# EasyEDA Pro project departure_board_display.epro

# Schematic 3_digit_7_segment

## Sheets
1 LEDs: Create Date: 2024-04-22; Page Name: LEDs; Project Name: 3_digit_WS2812B; Schematic Name: 3_digit_7_segment; Update Date: 2024-04-22; Company: Justin&apos;s Engineering Services; Drawed: Justin Forgue; Page Size: A1; Reviewed: EasyEDA Pro; Version: 0
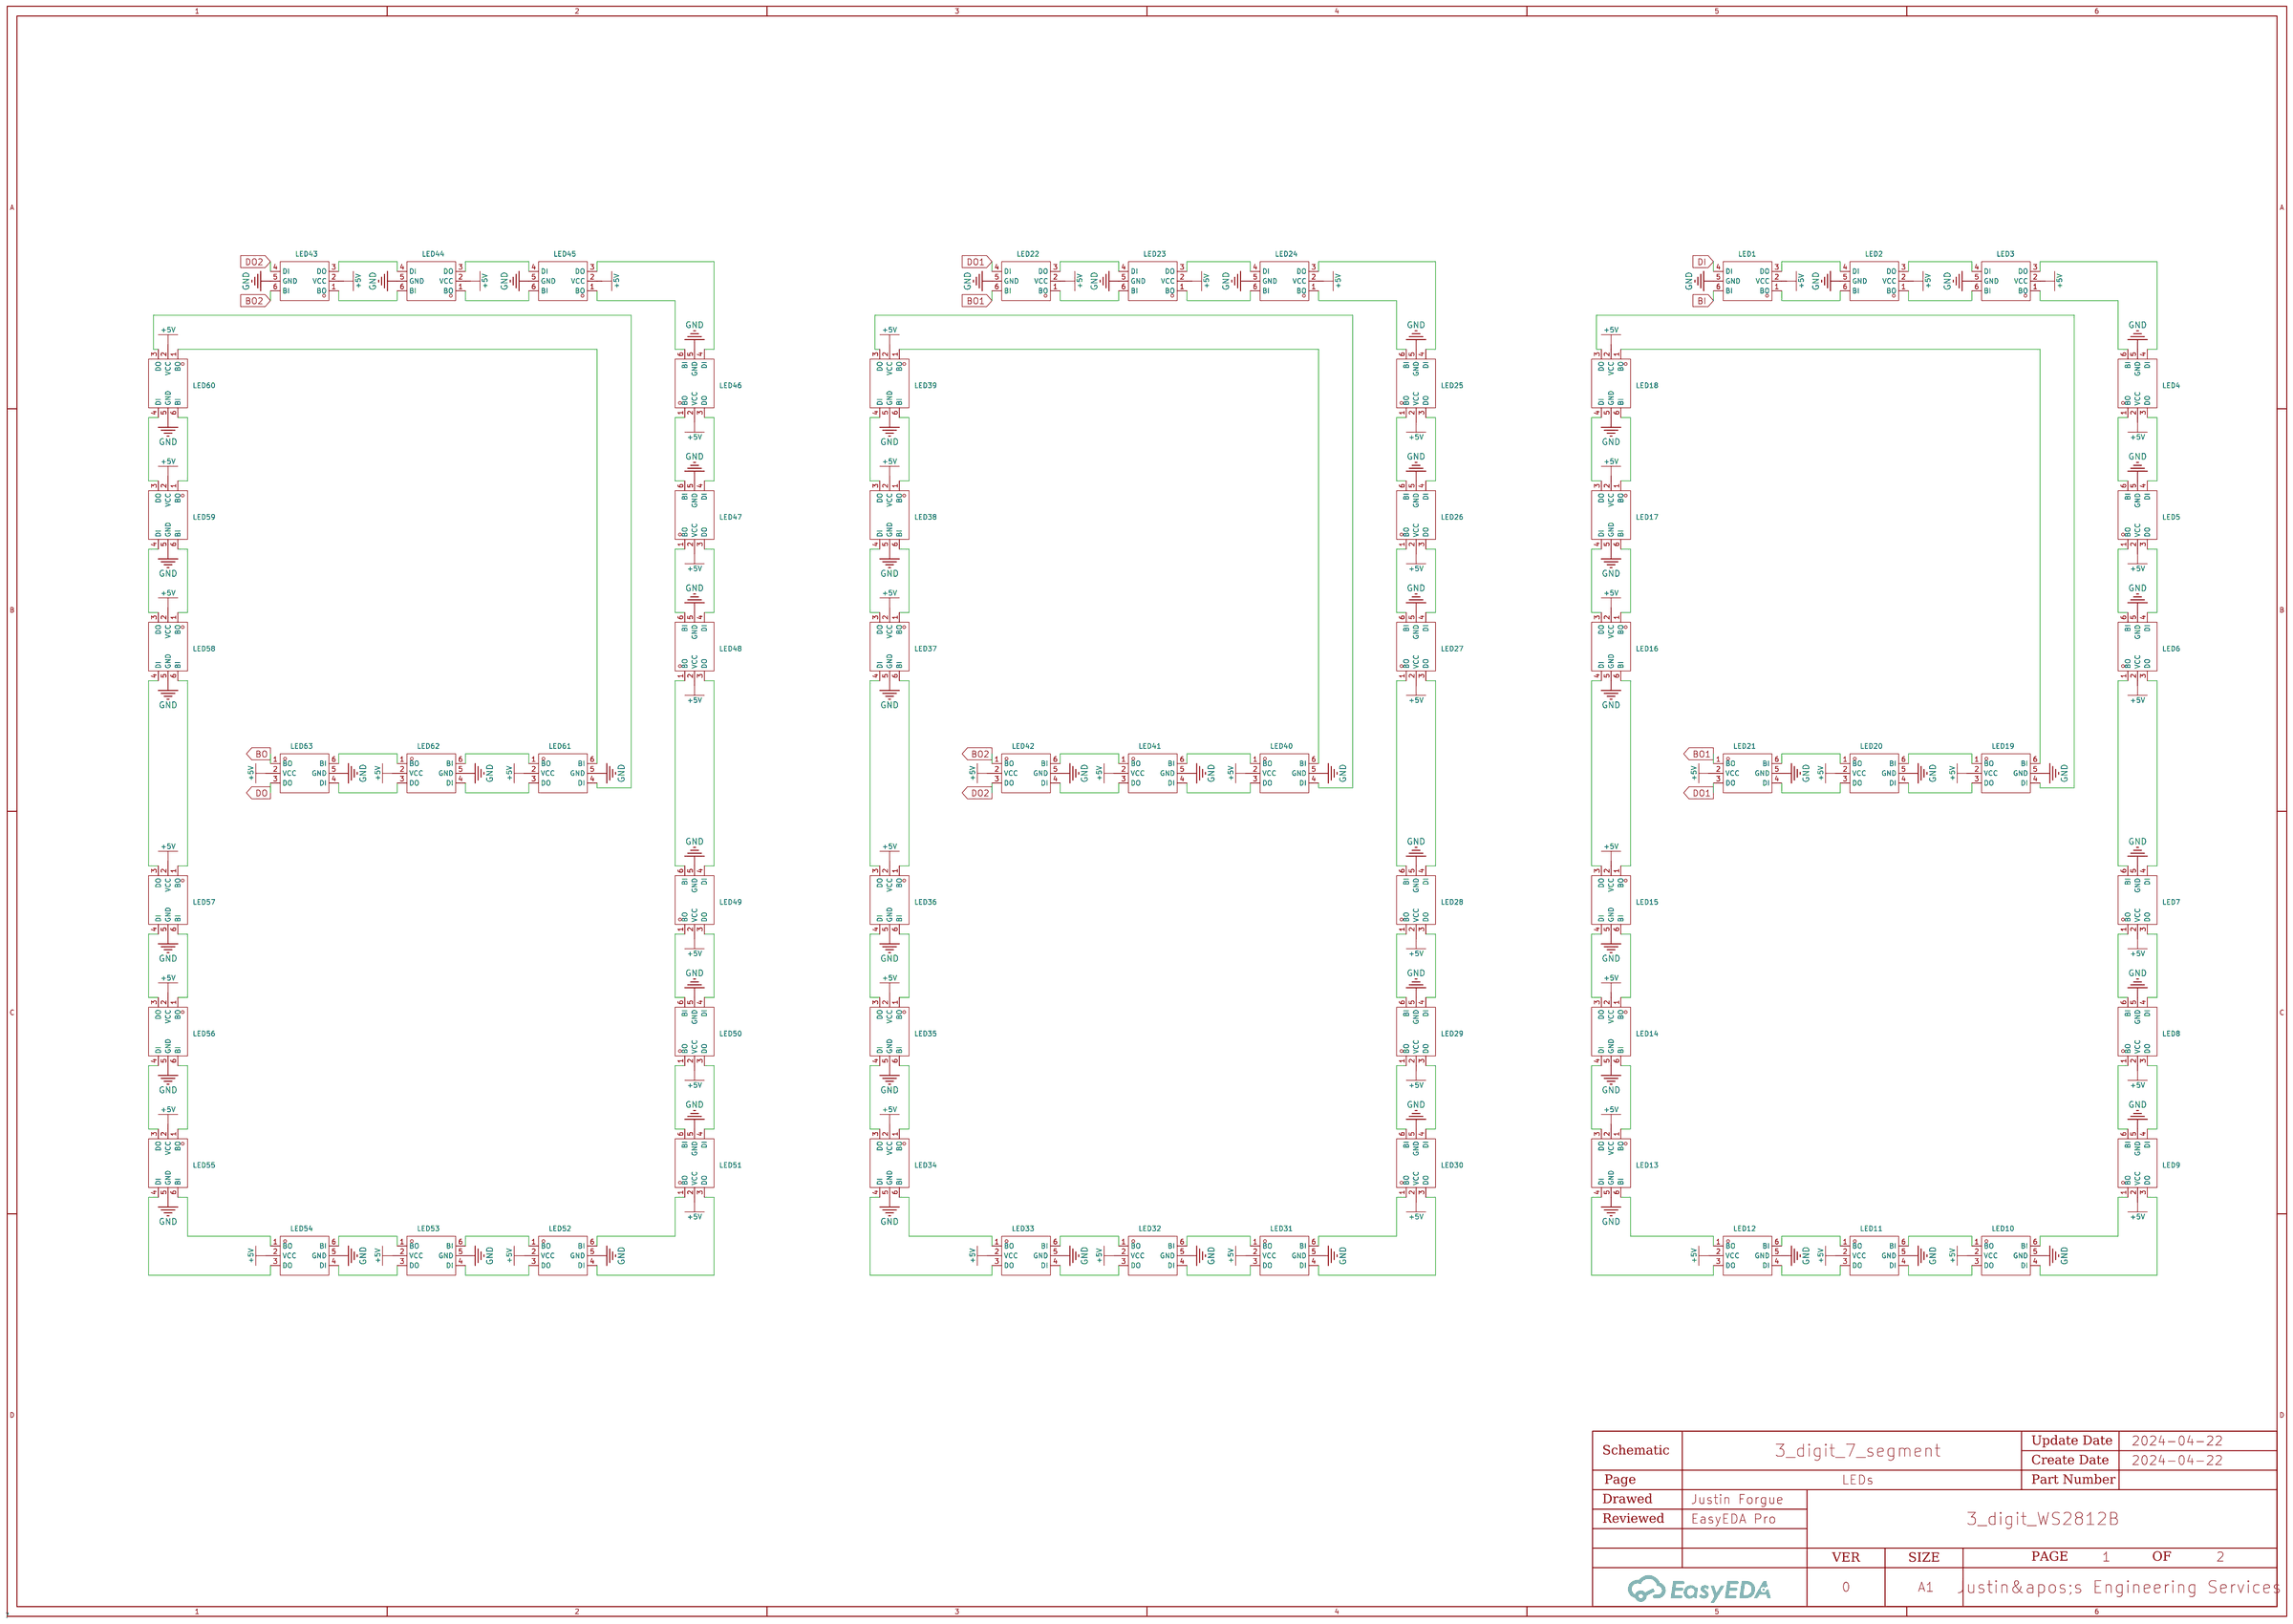
[diagram p0: LEDs]
2 Components: Board Name: Board1; Page Name: Components; Update Date: 2024-08-15; Drawed: EasyEDAPro; Reviewed: EasyEDAPro
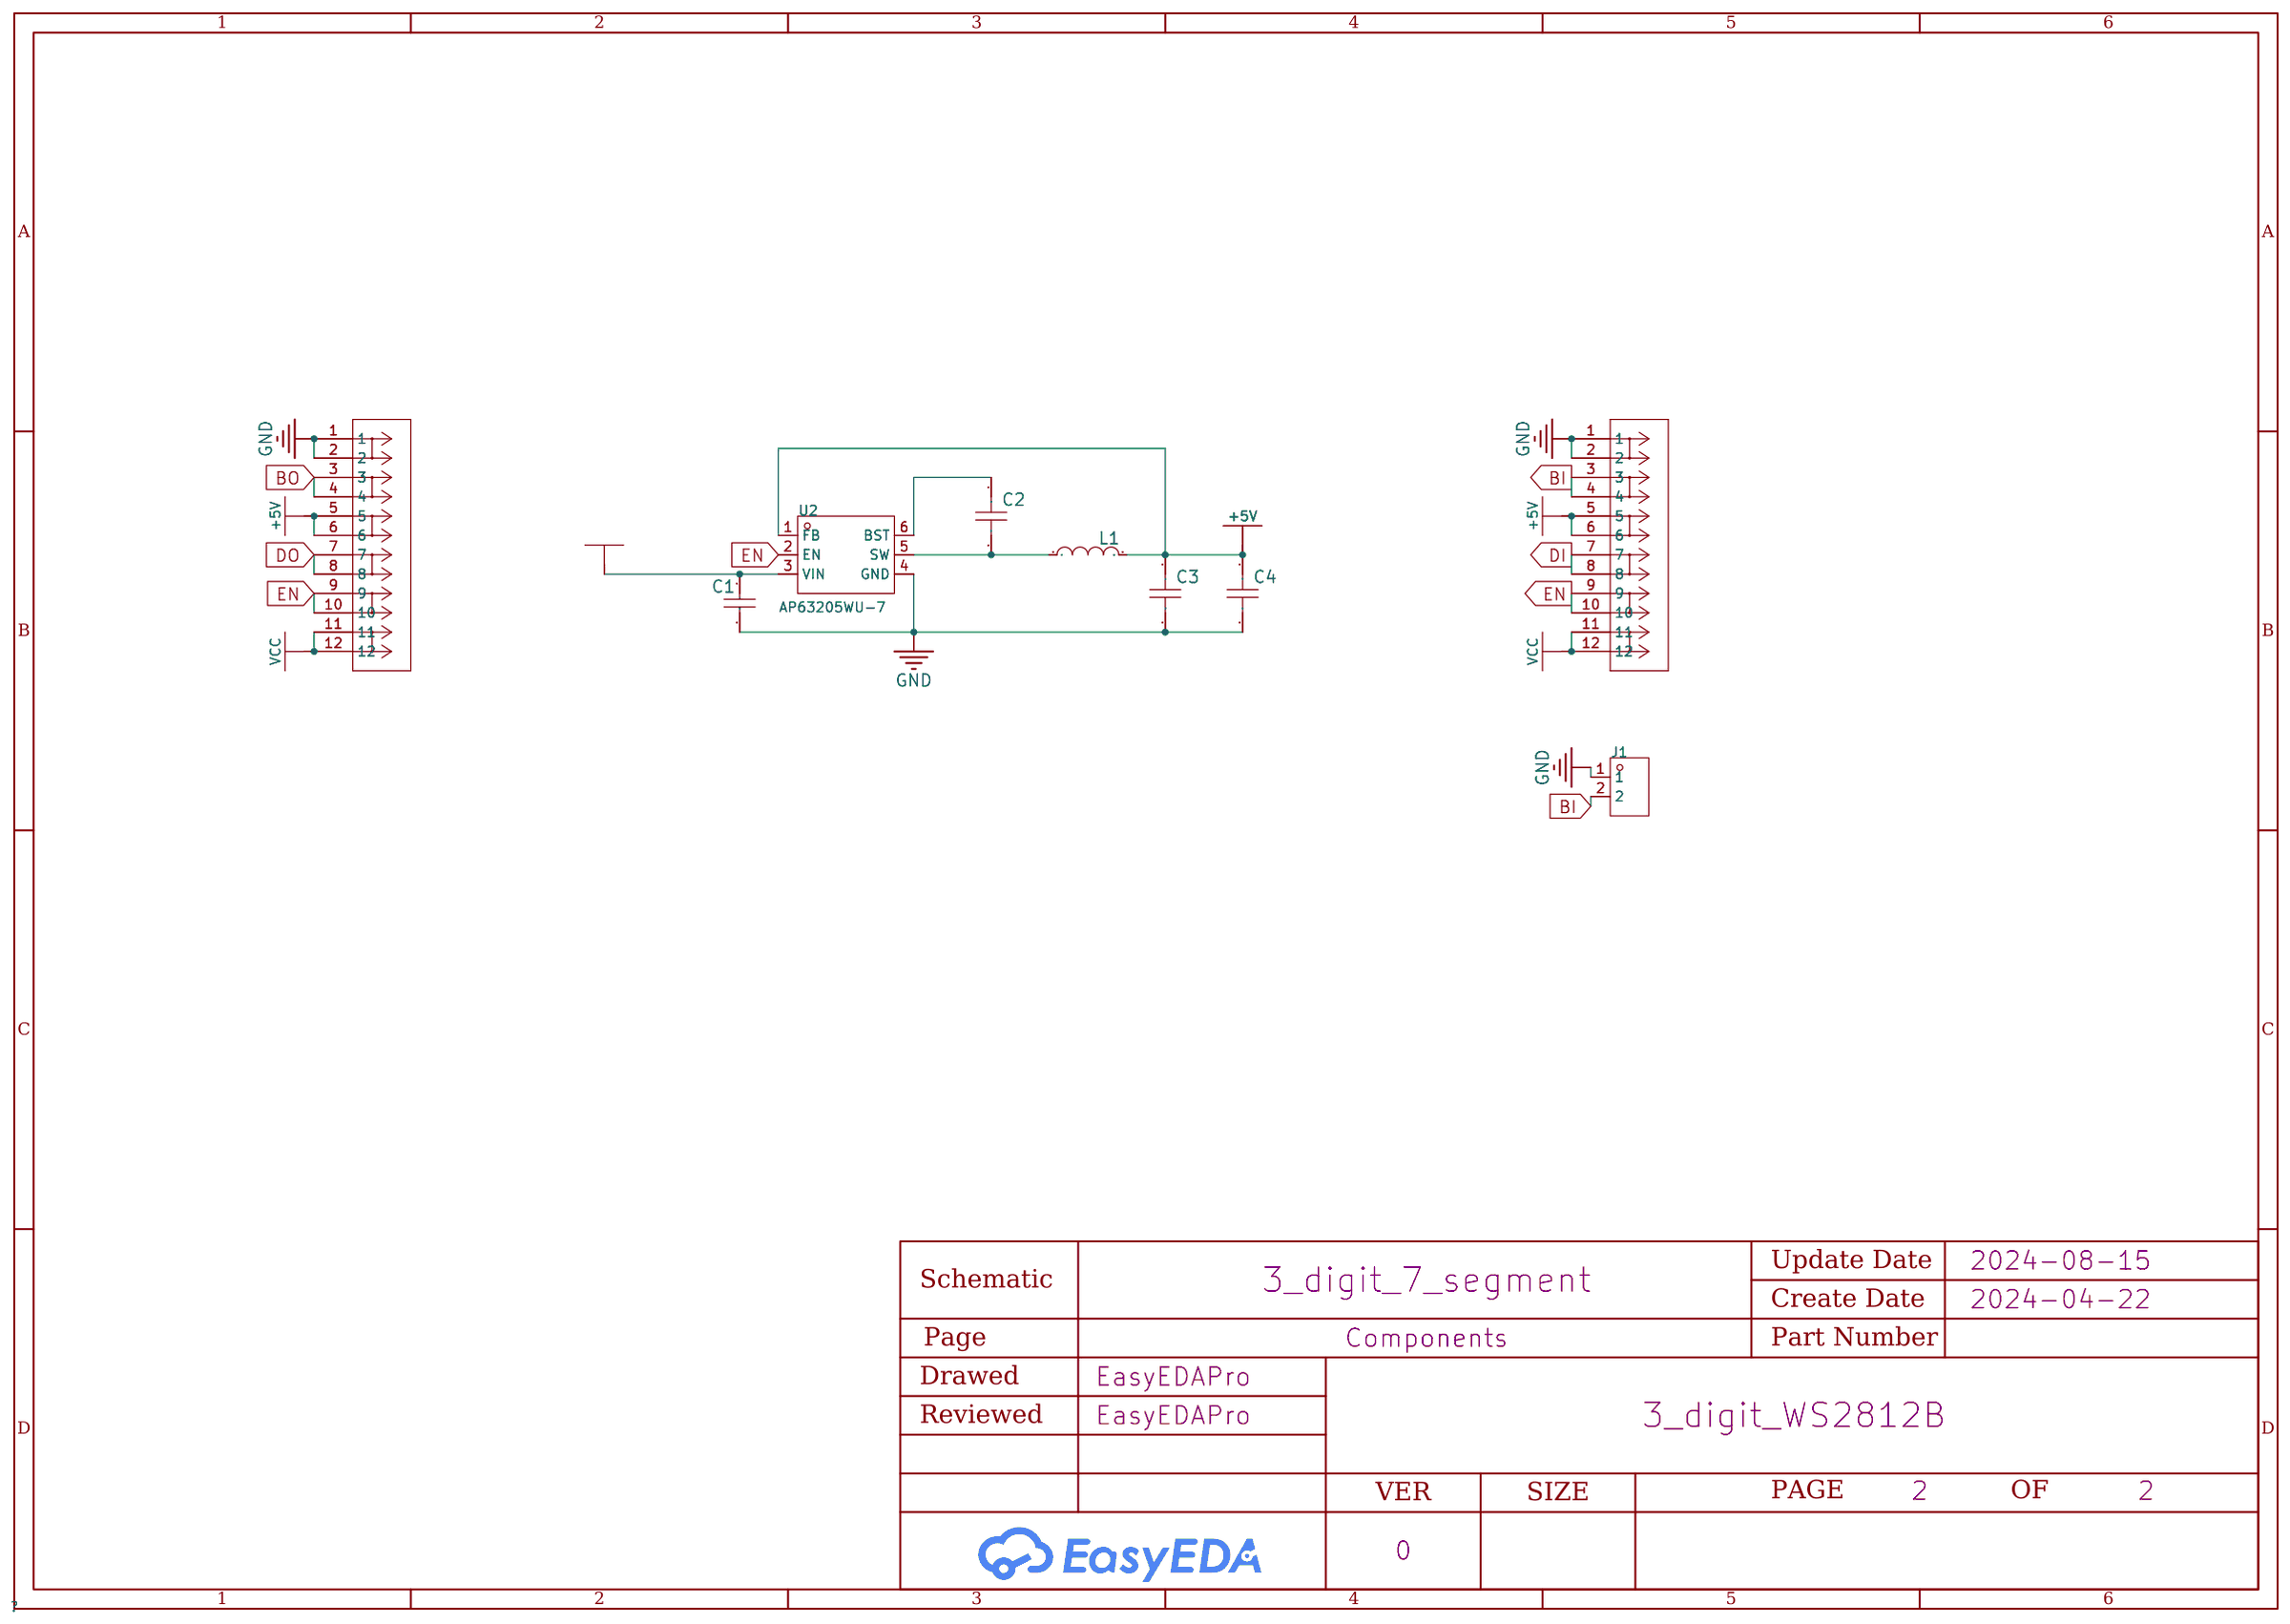
[diagram p1: Components]

## Parts
sheet Components
C1  10uF  [C1210]
C2  100nF  [C1206]
C3  22uF  [C1210]
C4  22uF  [C1210]
H1  -  [CONN_1814605]
H2  -  [CONN_1814605]
J1  PZ254V-11-02P  [HDR-TH_2P-P2.54-V-M]
L1  4.7uH  [IND-SMD_L3.2-W2.5_CMI3225XX]
U2  AP63205WU-7  [TSOT-23-6_L2.9-W1.6-P0.95-LS2.8-BL]
sheet LEDs
LED1  WS2813B-V5  [LED-SMD_6P-L5.0-W5.0-TL]
LED2  WS2813B-V5  [LED-SMD_6P-L5.0-W5.0-TL]
LED3  WS2813B-V5  [LED-SMD_6P-L5.0-W5.0-TL]
LED4  WS2813B-V5  [LED-SMD_6P-L5.0-W5.0-TL]
LED5  WS2813B-V5  [LED-SMD_6P-L5.0-W5.0-TL]
LED6  WS2813B-V5  [LED-SMD_6P-L5.0-W5.0-TL]
LED7  WS2813B-V5  [LED-SMD_6P-L5.0-W5.0-TL]
LED8  WS2813B-V5  [LED-SMD_6P-L5.0-W5.0-TL]
LED9  WS2813B-V5  [LED-SMD_6P-L5.0-W5.0-TL]
LED10  WS2813B-V5  [LED-SMD_6P-L5.0-W5.0-TL]
LED11  WS2813B-V5  [LED-SMD_6P-L5.0-W5.0-TL]
LED12  WS2813B-V5  [LED-SMD_6P-L5.0-W5.0-TL]
LED13  WS2813B-V5  [LED-SMD_6P-L5.0-W5.0-TL]
LED14  WS2813B-V5  [LED-SMD_6P-L5.0-W5.0-TL]
LED15  WS2813B-V5  [LED-SMD_6P-L5.0-W5.0-TL]
LED16  WS2813B-V5  [LED-SMD_6P-L5.0-W5.0-TL]
LED17  WS2813B-V5  [LED-SMD_6P-L5.0-W5.0-TL]
LED18  WS2813B-V5  [LED-SMD_6P-L5.0-W5.0-TL]
LED19  WS2813B-V5  [LED-SMD_6P-L5.0-W5.0-TL]
LED20  WS2813B-V5  [LED-SMD_6P-L5.0-W5.0-TL]
LED21  WS2813B-V5  [LED-SMD_6P-L5.0-W5.0-TL]
LED22  WS2813B-V5  [LED-SMD_6P-L5.0-W5.0-TL]
LED23  WS2813B-V5  [LED-SMD_6P-L5.0-W5.0-TL]
LED24  WS2813B-V5  [LED-SMD_6P-L5.0-W5.0-TL]
LED25  WS2813B-V5  [LED-SMD_6P-L5.0-W5.0-TL]
LED26  WS2813B-V5  [LED-SMD_6P-L5.0-W5.0-TL]
LED27  WS2813B-V5  [LED-SMD_6P-L5.0-W5.0-TL]
LED28  WS2813B-V5  [LED-SMD_6P-L5.0-W5.0-TL]
LED29  WS2813B-V5  [LED-SMD_6P-L5.0-W5.0-TL]
LED30  WS2813B-V5  [LED-SMD_6P-L5.0-W5.0-TL]
LED31  WS2813B-V5  [LED-SMD_6P-L5.0-W5.0-TL]
LED32  WS2813B-V5  [LED-SMD_6P-L5.0-W5.0-TL]
LED33  WS2813B-V5  [LED-SMD_6P-L5.0-W5.0-TL]
LED34  WS2813B-V5  [LED-SMD_6P-L5.0-W5.0-TL]
LED35  WS2813B-V5  [LED-SMD_6P-L5.0-W5.0-TL]
LED36  WS2813B-V5  [LED-SMD_6P-L5.0-W5.0-TL]
LED37  WS2813B-V5  [LED-SMD_6P-L5.0-W5.0-TL]
LED38  WS2813B-V5  [LED-SMD_6P-L5.0-W5.0-TL]
LED39  WS2813B-V5  [LED-SMD_6P-L5.0-W5.0-TL]
LED40  WS2813B-V5  [LED-SMD_6P-L5.0-W5.0-TL]
LED41  WS2813B-V5  [LED-SMD_6P-L5.0-W5.0-TL]
LED42  WS2813B-V5  [LED-SMD_6P-L5.0-W5.0-TL]
LED43  WS2813B-V5  [LED-SMD_6P-L5.0-W5.0-TL]
LED44  WS2813B-V5  [LED-SMD_6P-L5.0-W5.0-TL]
LED45  WS2813B-V5  [LED-SMD_6P-L5.0-W5.0-TL]
LED46  WS2813B-V5  [LED-SMD_6P-L5.0-W5.0-TL]
LED47  WS2813B-V5  [LED-SMD_6P-L5.0-W5.0-TL]
LED48  WS2813B-V5  [LED-SMD_6P-L5.0-W5.0-TL]
LED49  WS2813B-V5  [LED-SMD_6P-L5.0-W5.0-TL]
LED50  WS2813B-V5  [LED-SMD_6P-L5.0-W5.0-TL]
LED51  WS2813B-V5  [LED-SMD_6P-L5.0-W5.0-TL]
LED52  WS2813B-V5  [LED-SMD_6P-L5.0-W5.0-TL]
LED53  WS2813B-V5  [LED-SMD_6P-L5.0-W5.0-TL]
LED54  WS2813B-V5  [LED-SMD_6P-L5.0-W5.0-TL]
LED55  WS2813B-V5  [LED-SMD_6P-L5.0-W5.0-TL]
LED56  WS2813B-V5  [LED-SMD_6P-L5.0-W5.0-TL]
LED57  WS2813B-V5  [LED-SMD_6P-L5.0-W5.0-TL]
LED58  WS2813B-V5  [LED-SMD_6P-L5.0-W5.0-TL]
LED59  WS2813B-V5  [LED-SMD_6P-L5.0-W5.0-TL]
LED60  WS2813B-V5  [LED-SMD_6P-L5.0-W5.0-TL]
LED61  WS2813B-V5  [LED-SMD_6P-L5.0-W5.0-TL]
LED62  WS2813B-V5  [LED-SMD_6P-L5.0-W5.0-TL]
LED63  WS2813B-V5  [LED-SMD_6P-L5.0-W5.0-TL]

## Library data of the parts
C1 = CL32B106KAJNNNE: Capacitance: Tolerance:±10% Tolerance:±10% Voltage Rated: Temperature Coefficient:; LCSC Part Name: 10uF ±10% 25V; Supplier Part: C39232; Manufacturer: SAMSUNG(三星); Supplier Footprint: 1210; JLCPCB Part Class: Extended Part; Datasheet: https://atta.szlcsc.com/upload/public/pdf/source/20160218/1457707763339.pdf; Supplier: LCSC; Tolerance: ±10%; Check: false
C2 = 1206N104J500CT: Capacitance: Tolerance:±5% Tolerance:±5% Voltage Rated: Temperature Coefficient:; LCSC Part Name: 100nF ±5% 50V; Supplier Part: C170182; Manufacturer: Walsin(华新科); Supplier Footprint: 1206; JLCPCB Part Class: Extended Part; Datasheet: https://atta.szlcsc.com/upload/public/pdf/source/20190524/C388053_0CD3F469255EF43E616A57DAC128F58D.pdf; Supplier: LCSC; Tolerance: ±5%; Check: false
C3 C4 = CL32B226KAJNNNE: Capacitance: Tolerance:±10% Tolerance:±10% Voltage Rated: Temperature Coefficient:; LCSC Part Name: 22uF ±10% 25V; Supplier Part: C309062; Manufacturer: SAMSUNG(三星); Supplier Footprint: 1210; JLCPCB Part Class: Extended Part; Datasheet: https://atta.szlcsc.com/upload/public/pdf/source/20160218/1457707763339.pdf; Supplier: LCSC; Tolerance: ±10%; Check: false
H1 H2 = TERM BLK 6P TOP ENTRY 2.5MM PCB
J1 = PZ254V-11-02P: Pin Structure:1x2P Pitch:2.54mm Row Spacing:- Circluar Pins/Square Pins:Square Pins Mounting Type:Straight Number of Rows:Plugin Number of Pins:2P Current Rating (Max):- Voltage Rating (Max):- Length of Mating Pin:6mm Insulation Height:2.5mm Length of End; LCSC Part Name: 间距:2.54mm 1x2P 直插 方针; Supplier Part: C492401; Manufacturer: XFCN(兴飞); Supplier Footprint: 插件,P=2.54mm; JLCPCB Part Class: Extended Part; Datasheet: https://atta.szlcsc.com/upload/public/pdf/source/20200309/C492401_A812433581A9B211A7FFA413ADDFF0E5.pdf; Supplier: LCSC; Pin Structure: 1x2P; Pitch: 2.54mm; Circluar Pins/Square Pins: Square Pins; Mounting Type: Straight; Number of Rows: Plugin; Number of Pins: 2P; Length of Mating Pin: 6mm; Insulation Height: 2.5mm; Length of End Connection Pin: 3mm; Operating Temperature Range: -40℃~+105℃; Color: Black
L1 = DFE322520FD-4R7M=P2: Inductance: Tolerance:±20% Tolerance:±20% Rated Current:2A Saturation Current (Isat):3.4A DC Resistance (DCR): Ratings:AEC-Q200; LCSC Part Name: 4.7uH ±20% 3.4A; Supplier Part: C2045343; Manufacturer: muRata(村田); Supplier Footprint: 1210; JLCPCB Part Class: Extended Part; Datasheet: https://atta.szlcsc.com/upload/public/pdf/source/20230811/E685BADDC9D496FFC5350CE0F3D93440.pdf; Supplier: LCSC; Tolerance: ±20%; Rated Current: 2A; Saturation Current (Isat): 3.4A; DC Resistance (DCR): 34.5mΩ; Ratings: AEC-Q200; Check: false
U2 = AP63205WU-7: Function:Step-down type Synchronous Rectification:Yes Output Type:Fixed Number of Outputs:1 Topology:Step-down Input Voltage:3.8V~32V Input Voltage:3.8V~32V Output Voltage:5V Output Voltage:5V Output Current (Max):2A Switching Frequency:1.1MHz Operating T; LCSC Part Name: 降压型 输入3.8V~32V 输出5V 2A; Supplier Part: C2071056; Manufacturer: DIODES(美台); Supplier Footprint: TSOT-26-6; JLCPCB Part Class: Extended Part; Datasheet: https://atta.szlcsc.com/upload/public/pdf/source/20210622/C780769_099C67289BD3EC61AAFB52D8B07125B3.pdf; Supplier: LCSC; Function: Step-down type; Synchronous Rectification: Yes; Output Type: Fixed; Number of Outputs: 1; Topology: Step-down; Input Voltage: 3.8V~32V; Output Voltage: 5V; Output Current (Max): 2A; Switching Frequency: 1.1MHz; Operating Temperature: -40℃~+85℃@(TA); Check: false
LED1-LED63 = WS2813B-V5: Emitted Color:RGB Power Dissipation:- Forward Current:16mA Dominant Wavelength:623nm；471nm；520nm Dominant Wavelength:623nm；471nm；520nm Peak Wavelength:- Diode Configuration:- Lens Color:- Color Temperature:- Color Temperature:- Viewing Angle:- Mounting Sy; LCSC Part Name: RGB三色; Supplier Part: C965558; Manufacturer: worldsemi; Supplier Footprint: SMD5050; JLCPCB Part Class: Extended Part; Datasheet: https://atta.szlcsc.com/upload/public/pdf/source/20201203/C965558_3788C892C3E72C9CF7EE66566AC16D5A.pdf; Supplier: LCSC; Emitted Color: RGB; Forward Current: 16mA; Dominant Wavelength: 623nm；471nm；520nm; Check: false

## Nets
+5V: C3.1 C4.1 H1.5 H1.6 H2.5 H2.6 L1.2 LED1.2(VCC) LED2.2(VCC) LED3.2(VCC) LED4.2(VCC) LED5.2(VCC) LED6.2(VCC) LED7.2(VCC) LED8.2(VCC) LED9.2(VCC) LED10.2(VCC) LED11.2(VCC) LED12.2(VCC) LED13.2(VCC) LED14.2(VCC) LED15.2(VCC) LED16.2(VCC) LED17.2(VCC) LED18.2(VCC) LED19.2(VCC) LED20.2(VCC) LED21.2(VCC) LED22.2(VCC) LED23.2(VCC) LED24.2(VCC) LED25.2(VCC) LED26.2(VCC) LED27.2(VCC) LED28.2(VCC) LED29.2(VCC) LED30.2(VCC) LED31.2(VCC) LED32.2(VCC) LED33.2(VCC) LED34.2(VCC) LED35.2(VCC) LED36.2(VCC) LED37.2(VCC) LED38.2(VCC) LED39.2(VCC) LED40.2(VCC) LED41.2(VCC) LED42.2(VCC) LED43.2(VCC) LED44.2(VCC) LED45.2(VCC) LED46.2(VCC) LED47.2(VCC) LED48.2(VCC) LED49.2(VCC) LED50.2(VCC) LED51.2(VCC) LED52.2(VCC) LED53.2(VCC) LED54.2(VCC) LED55.2(VCC) LED56.2(VCC) LED57.2(VCC) LED58.2(VCC) LED59.2(VCC) LED60.2(VCC) LED61.2(VCC) LED62.2(VCC) LED63.2(VCC) U2.1(FB)
GND: C1.2 C3.2 C4.2 H1.1 H1.2 H2.1 H2.2 J1.1 LED1.5(GND) LED2.5(GND) LED3.5(GND) LED4.5(GND) LED5.5(GND) LED6.5(GND) LED7.5(GND) LED8.5(GND) LED9.5(GND) LED10.5(GND) LED11.5(GND) LED12.5(GND) LED13.5(GND) LED14.5(GND) LED15.5(GND) LED16.5(GND) LED17.5(GND) LED18.5(GND) LED19.5(GND) LED20.5(GND) LED21.5(GND) LED22.5(GND) LED23.5(GND) LED24.5(GND) LED25.5(GND) LED26.5(GND) LED27.5(GND) LED28.5(GND) LED29.5(GND) LED30.5(GND) LED31.5(GND) LED32.5(GND) LED33.5(GND) LED34.5(GND) LED35.5(GND) LED36.5(GND) LED37.5(GND) LED38.5(GND) LED39.5(GND) LED40.5(GND) LED41.5(GND) LED42.5(GND) LED43.5(GND) LED44.5(GND) LED45.5(GND) LED46.5(GND) LED47.5(GND) LED48.5(GND) LED49.5(GND) LED50.5(GND) LED51.5(GND) LED52.5(GND) LED53.5(GND) LED54.5(GND) LED55.5(GND) LED56.5(GND) LED57.5(GND) LED58.5(GND) LED59.5(GND) LED60.5(GND) LED61.5(GND) LED62.5(GND) LED63.5(GND) U2.4(GND)
VCC: C1.1 H1.11 H1.12 H2.11 H2.12 U2.3(VIN)
BI: H1.3 H1.4 J1.2 LED1.6(BI)
BO: H2.3 H2.4 LED63.1(BO)
BO1: LED21.1(BO) LED22.6(BI)
BO2: LED42.1(BO) LED43.6(BI)
DI: H1.7 H1.8 LED1.4(DI)
DO: H2.7 H2.8 LED63.3(DO)
DO1: LED21.3(DO) LED22.4(DI)
DO2: LED42.3(DO) LED43.4(DI)
EN: H1.9 H1.10 H2.9 H2.10 U2.2(EN)
$2N332268: LED1.3(DO) LED2.4(DI)
$2N332275: LED2.3(DO) LED3.4(DI)
$2N332294: LED1.1(BO) LED2.6(BI)
$2N332300: LED2.1(BO) LED3.6(BI)
$2N332306: LED3.1(BO) LED4.6(BI)
$2N332313: LED3.3(DO) LED4.4(DI)
$2N332321: LED4.1(BO) LED5.6(BI)
$2N332324: LED4.3(DO) LED5.4(DI)
$2N332327: LED5.1(BO) LED6.6(BI)
$2N332330: LED5.3(DO) LED6.4(DI)
$2N332493: LED7.1(BO) LED8.6(BI)
$2N332495: LED7.3(DO) LED8.4(DI)
$2N332497: LED8.1(BO) LED9.6(BI)
$2N332499: LED8.3(DO) LED9.4(DI)
$2N332503: LED9.1(BO) LED10.6(BI)
$2N332507: LED9.3(DO) LED10.4(DI)
$2N332511: LED10.3(DO) LED11.4(DI)
$2N332514: LED10.1(BO) LED11.6(BI)
$2N332517: LED11.1(BO) LED12.6(BI)
$2N332520: LED11.3(DO) LED12.4(DI)
$2N332523: LED12.3(DO) LED13.4(DI)
$2N332527: LED12.1(BO) LED13.6(BI)
$2N332531: LED13.3(DO) LED14.4(DI)
$2N332534: LED13.1(BO) LED14.6(BI)
$2N332537: LED14.3(DO) LED15.4(DI)
$2N332543: LED14.1(BO) LED15.6(BI)
$2N332549: LED15.3(DO) LED16.4(DI)
$2N332556: LED15.1(BO) LED16.6(BI)
$2N332563: LED16.3(DO) LED17.4(DI)
$2N332570: LED16.1(BO) LED17.6(BI)
$2N332577: LED17.3(DO) LED18.4(DI)
$2N332584: LED17.1(BO) LED18.6(BI)
$2N332696: LED6.1(BO) LED7.6(BI)
$2N332699: LED6.3(DO) LED7.4(DI)
$2N332702: LED18.1(BO) LED19.6(BI)
$2N332706: LED18.3(DO) LED19.4(DI)
$2N332712: LED19.1(BO) LED20.6(BI)
$2N332718: LED19.3(DO) LED20.4(DI)
$2N332724: LED20.1(BO) LED21.6(BI)
$2N332731: LED20.3(DO) LED21.4(DI)
$2N335047: LED22.3(DO) LED23.4(DI)
$2N335051: LED23.3(DO) LED24.4(DI)
$2N335055: LED22.1(BO) LED23.6(BI)
$2N335060: LED23.1(BO) LED24.6(BI)
$2N335064: LED24.1(BO) LED25.6(BI)
$2N335069: LED24.3(DO) LED25.4(DI)
$2N335074: LED25.1(BO) LED26.6(BI)
$2N335078: LED25.3(DO) LED26.4(DI)
$2N335082: LED26.1(BO) LED27.6(BI)
$2N335086: LED26.3(DO) LED27.4(DI)
$2N335090: LED28.1(BO) LED29.6(BI)
$2N335094: LED28.3(DO) LED29.4(DI)
$2N335098: LED29.1(BO) LED30.6(BI)
$2N335102: LED29.3(DO) LED30.4(DI)
$2N335106: LED30.1(BO) LED31.6(BI)
$2N335111: LED30.3(DO) LED31.4(DI)
$2N335116: LED31.3(DO) LED32.4(DI)
$2N335120: LED31.1(BO) LED32.6(BI)
$2N335124: LED32.1(BO) LED33.6(BI)
$2N335128: LED32.3(DO) LED33.4(DI)
$2N335132: LED33.3(DO) LED34.4(DI)
$2N335137: LED33.1(BO) LED34.6(BI)
$2N335142: LED34.3(DO) LED35.4(DI)
$2N335146: LED34.1(BO) LED35.6(BI)
$2N335150: LED35.3(DO) LED36.4(DI)
$2N335154: LED35.1(BO) LED36.6(BI)
$2N335158: LED36.3(DO) LED37.4(DI)
$2N335162: LED36.1(BO) LED37.6(BI)
$2N335166: LED37.3(DO) LED38.4(DI)
$2N335170: LED37.1(BO) LED38.6(BI)
$2N335174: LED38.3(DO) LED39.4(DI)
$2N335178: LED38.1(BO) LED39.6(BI)
$2N335182: LED27.1(BO) LED28.6(BI)
$2N335186: LED27.3(DO) LED28.4(DI)
$2N335190: LED39.1(BO) LED40.6(BI)
$2N335193: LED39.3(DO) LED40.4(DI)
$2N335200: LED40.1(BO) LED41.6(BI)
$2N335204: LED40.3(DO) LED41.4(DI)
$2N335208: LED41.1(BO) LED42.6(BI)
$2N335212: LED41.3(DO) LED42.4(DI)
$2N338899: LED43.3(DO) LED44.4(DI)
$2N338903: LED44.3(DO) LED45.4(DI)
$2N338907: LED43.1(BO) LED44.6(BI)
$2N338911: LED44.1(BO) LED45.6(BI)
$2N338915: LED45.1(BO) LED46.6(BI)
$2N338920: LED45.3(DO) LED46.4(DI)
$2N338925: LED46.1(BO) LED47.6(BI)
$2N338929: LED46.3(DO) LED47.4(DI)
$2N338933: LED47.1(BO) LED48.6(BI)
$2N338937: LED47.3(DO) LED48.4(DI)
$2N338941: LED49.1(BO) LED50.6(BI)
$2N338945: LED49.3(DO) LED50.4(DI)
$2N338949: LED50.1(BO) LED51.6(BI)
$2N338953: LED50.3(DO) LED51.4(DI)
$2N338957: LED51.1(BO) LED52.6(BI)
$2N338962: LED51.3(DO) LED52.4(DI)
$2N338967: LED52.3(DO) LED53.4(DI)
$2N338971: LED52.1(BO) LED53.6(BI)
$2N338975: LED53.1(BO) LED54.6(BI)
$2N338979: LED53.3(DO) LED54.4(DI)
$2N338983: LED54.3(DO) LED55.4(DI)
$2N338988: LED54.1(BO) LED55.6(BI)
$2N338993: LED55.3(DO) LED56.4(DI)
$2N338997: LED55.1(BO) LED56.6(BI)
$2N339001: LED56.3(DO) LED57.4(DI)
$2N339005: LED56.1(BO) LED57.6(BI)
$2N339009: LED57.3(DO) LED58.4(DI)
$2N339013: LED57.1(BO) LED58.6(BI)
$2N339017: LED58.3(DO) LED59.4(DI)
$2N339021: LED58.1(BO) LED59.6(BI)
$2N339025: LED59.3(DO) LED60.4(DI)
$2N339029: LED59.1(BO) LED60.6(BI)
$2N339033: LED48.1(BO) LED49.6(BI)
$2N339037: LED48.3(DO) LED49.4(DI)
$2N339041: LED60.1(BO) LED61.6(BI)
$2N339044: LED60.3(DO) LED61.4(DI)
$2N339051: LED61.1(BO) LED62.6(BI)
$2N339055: LED61.3(DO) LED62.4(DI)
$2N339059: LED62.1(BO) LED63.6(BI)
$2N339063: LED62.3(DO) LED63.4(DI)
$3N5692: C2.2 L1.1 U2.5(SW)
$3N12733: C2.1 U2.6(BST)

# Board PCB_3_digit_7_segment
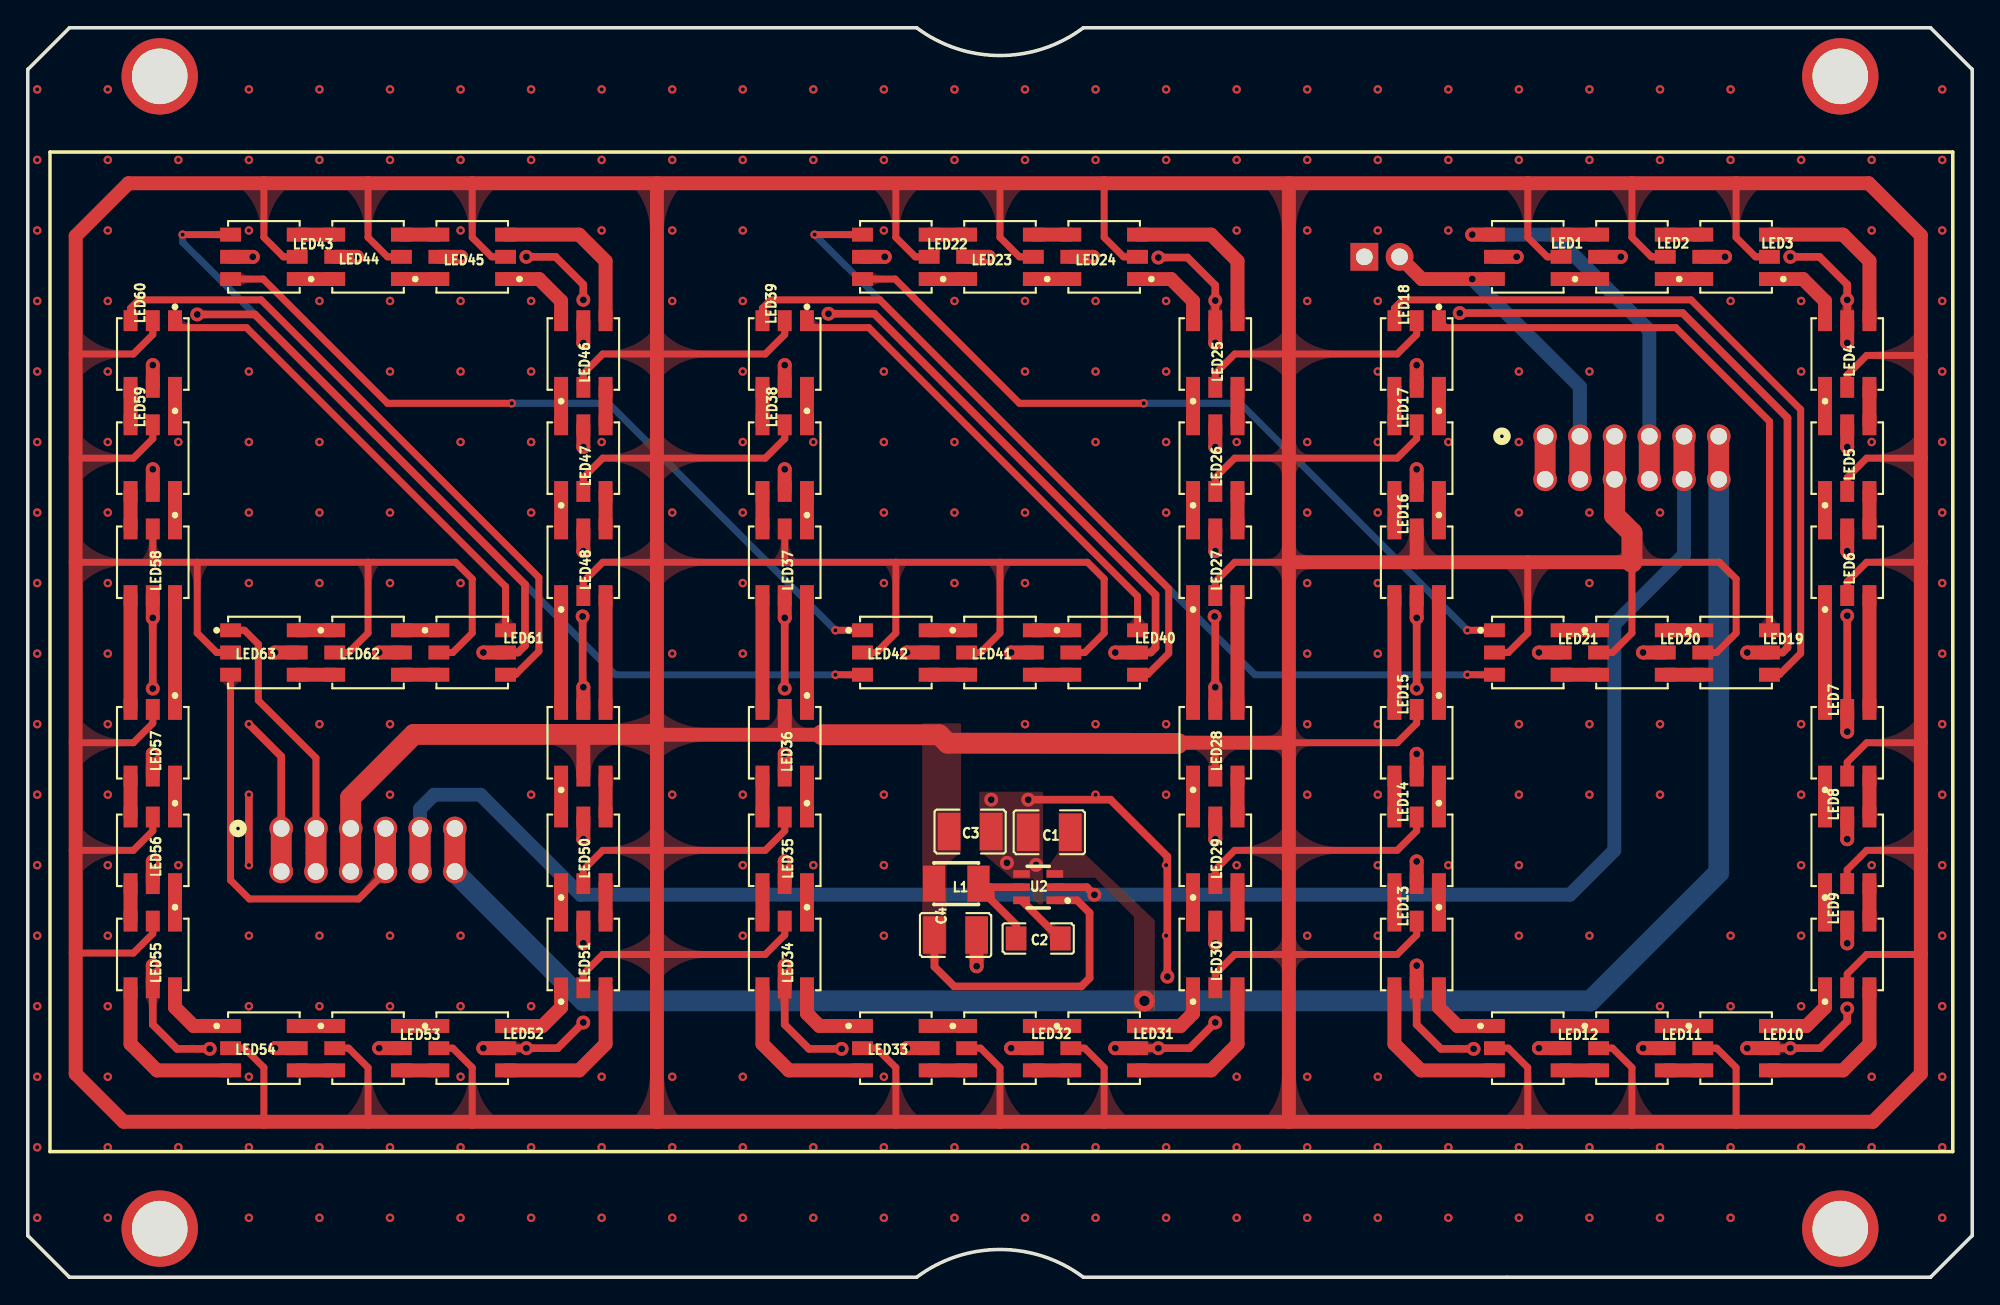
[diagram p2: board, top side]
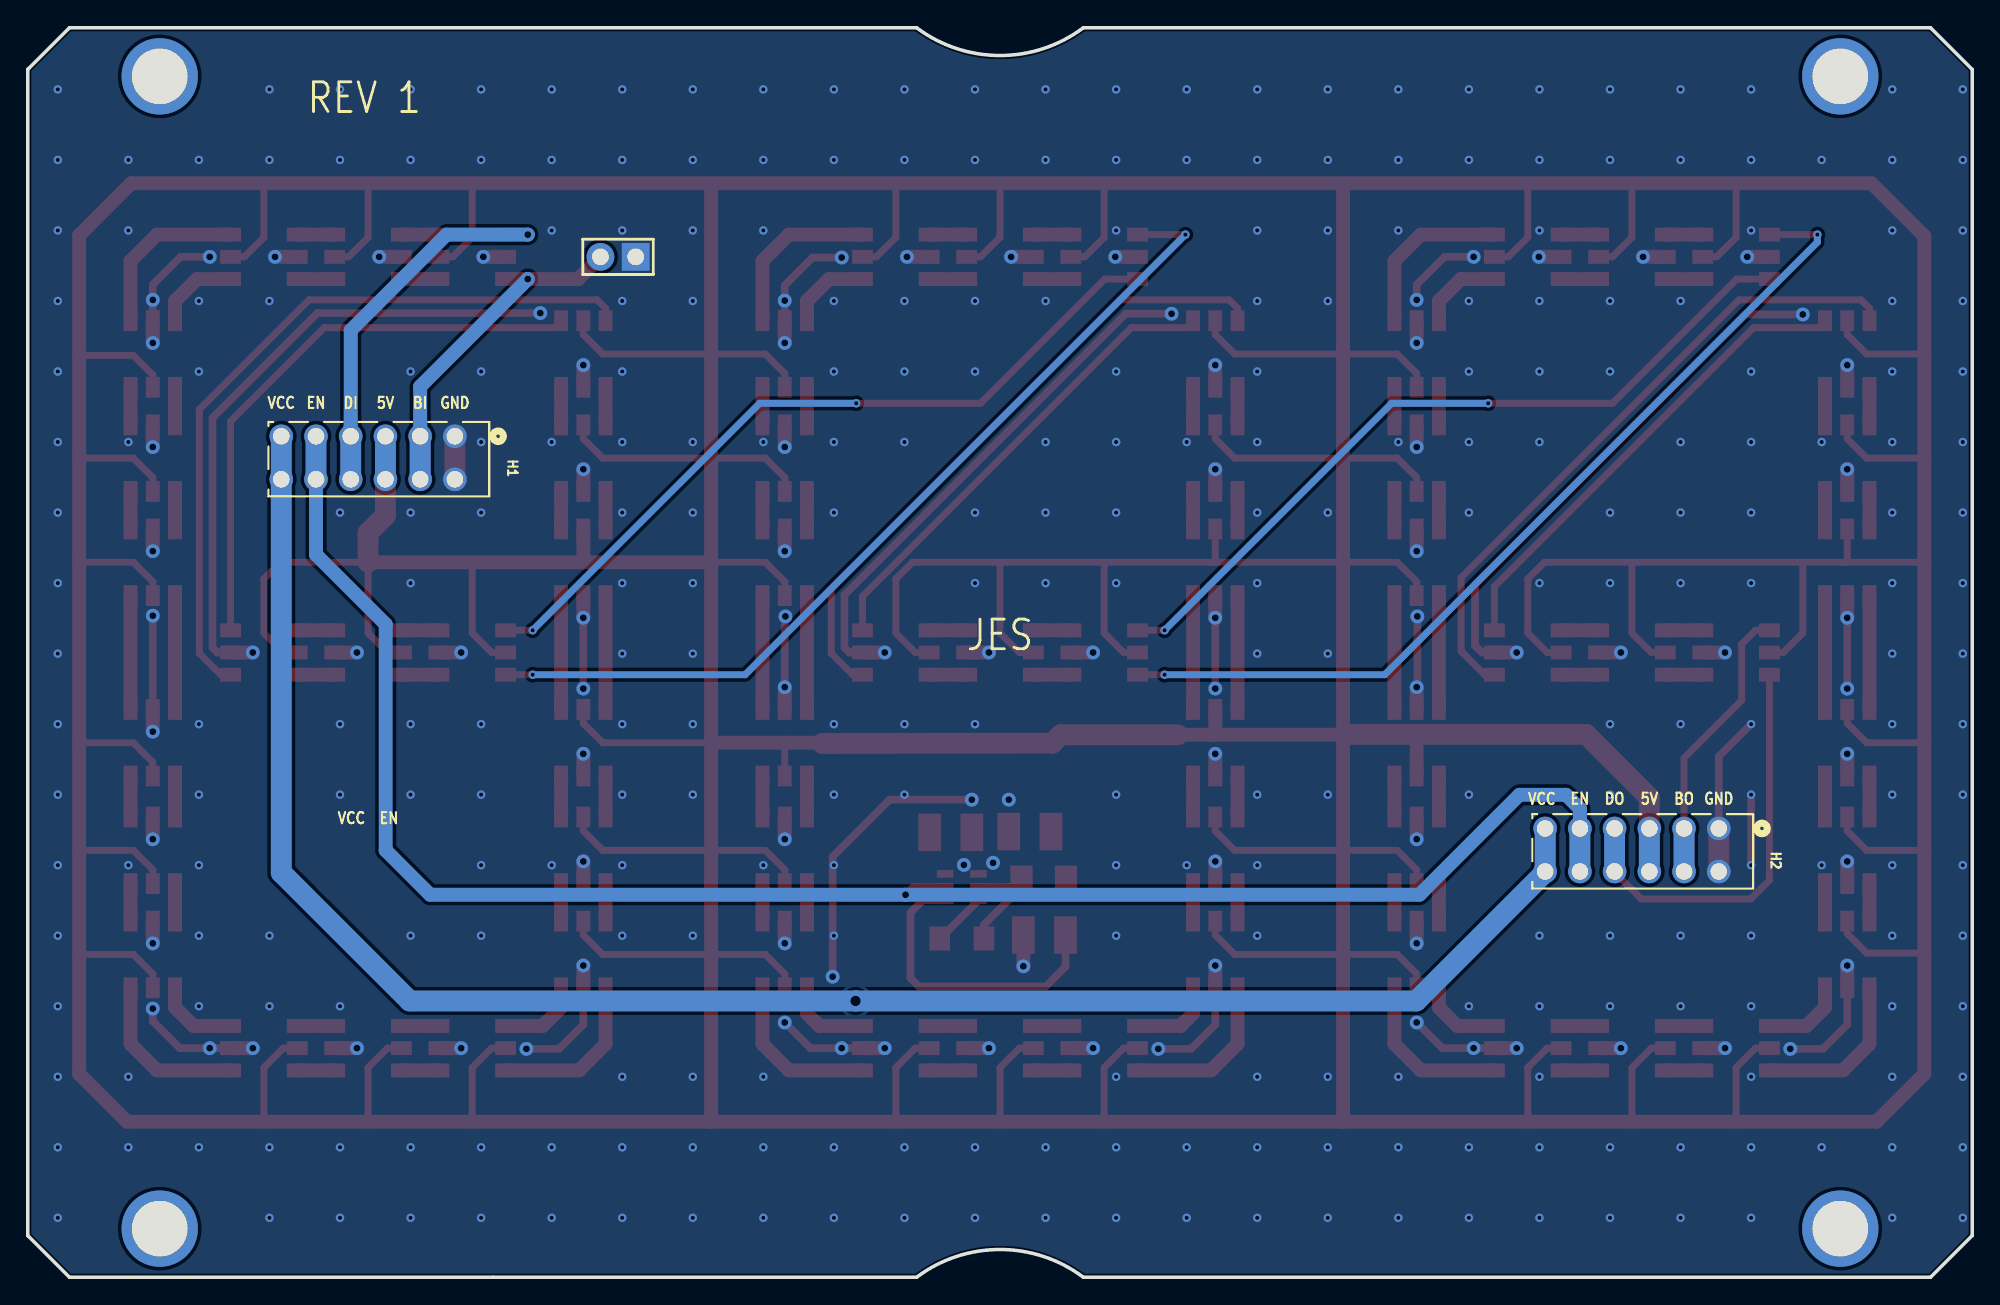
[diagram p3: board, bottom side, seen from below]

Outline 140 x 90 mm; copper layers: Top Layer, Bottom Layer. Coordinates in mm from the lower left corner of the outline.
Outline path: 0,87 3,90 64,90 arc(70,88) 76,90 137,90 140,87 140,3 137,0 76,0 arc(70,2) 64,0 3,0 0,3 0,87
Stack: Top Layer 0.035mm - / Dielectric1 1.51mm FR4 er 4.5 / Bottom Layer 0.035mm -

## Design rules (mm)
template: User Custom Config
spacing Default (default): track to track 0.152, other pairs 0 to 0.152
track width Default (default): min 0.2, default 0.254, max 25.4
track width VDD Bus: min 0.55, default 0.6, max 2.54
differential pair differentialPair (default): width min 0.127, default 0.254, max 2.54; gap min 0.152, default 0.152
via Default (default): diameter min 0.61, default 0.61, max 100.025; hole min 0.305, default 0.305, max 59.995
net GND uses direct
net +5V uses direct
net VCC uses direct

## Placement (name value [footprint] x y rotation side)
C1  10uF  [C1210]  73.55 32.05 180 top
C2  100nF  [C1206]  72.75 24.4 180 top
C3  22uF  [C1210]  67.85 32.1 0 top
C4  22uF  [C1210]  66.8 24.65 0 top
H1  -  [CONN_1814605]  115.5 59 0 bottom
H2  -  [CONN_1814605]  24.5 30.75 0 bottom
J1  PZ254V-11-02P  [HDR-TH_2P-P2.54-V-M]  97.5 73.5 0 bottom
L1  4.7uH  [IND-SMD_L3.2-W2.5_CMI3225XX]  66.85 28.35 180 top
LED1  WS2813B-V5  [LED-SMD_6P-L5.0-W5.0-TL]  108 73.5 180 top
LED2  WS2813B-V5  [LED-SMD_6P-L5.0-W5.0-TL]  115.5 73.5 180 top
LED3  WS2813B-V5  [LED-SMD_6P-L5.0-W5.0-TL]  123 73.5 180 top
LED4  WS2813B-V5  [LED-SMD_6P-L5.0-W5.0-TL]  131 66.5 90 top
LED5  WS2813B-V5  [LED-SMD_6P-L5.0-W5.0-TL]  131 59 90 top
LED6  WS2813B-V5  [LED-SMD_6P-L5.0-W5.0-TL]  131 51.5 90 top
LED7  WS2813B-V5  [LED-SMD_6P-L5.0-W5.0-TL]  131 38.5 90 top
LED8  WS2813B-V5  [LED-SMD_6P-L5.0-W5.0-TL]  131 30.75 90 top
LED9  WS2813B-V5  [LED-SMD_6P-L5.0-W5.0-TL]  131 23.25 90 top
LED10  WS2813B-V5  [LED-SMD_6P-L5.0-W5.0-TL]  123 16.5 0 top
LED11  WS2813B-V5  [LED-SMD_6P-L5.0-W5.0-TL]  115.5 16.5 0 top
LED12  WS2813B-V5  [LED-SMD_6P-L5.0-W5.0-TL]  108 16.5 0 top
LED13  WS2813B-V5  [LED-SMD_6P-L5.0-W5.0-TL]  100 23.25 270 top
LED14  WS2813B-V5  [LED-SMD_6P-L5.0-W5.0-TL]  100 30.75 270 top
LED15  WS2813B-V5  [LED-SMD_6P-L5.0-W5.0-TL]  100 38.5 270 top
LED16  WS2813B-V5  [LED-SMD_6P-L5.0-W5.0-TL]  100 51.5 270 top
LED17  WS2813B-V5  [LED-SMD_6P-L5.0-W5.0-TL]  100 59 270 top
LED18  WS2813B-V5  [LED-SMD_6P-L5.0-W5.0-TL]  100 66.5 270 top
LED19  WS2813B-V5  [LED-SMD_6P-L5.0-W5.0-TL]  123 45 0 top
LED20  WS2813B-V5  [LED-SMD_6P-L5.0-W5.0-TL]  115.5 45 0 top
LED21  WS2813B-V5  [LED-SMD_6P-L5.0-W5.0-TL]  108 45 0 top
LED22  WS2813B-V5  [LED-SMD_6P-L5.0-W5.0-TL]  62.5 73.5 180 top
LED23  WS2813B-V5  [LED-SMD_6P-L5.0-W5.0-TL]  70 73.5 180 top
LED24  WS2813B-V5  [LED-SMD_6P-L5.0-W5.0-TL]  77.5 73.5 180 top
LED25  WS2813B-V5  [LED-SMD_6P-L5.0-W5.0-TL]  85.5 66.5 90 top
LED26  WS2813B-V5  [LED-SMD_6P-L5.0-W5.0-TL]  85.5 59 90 top
LED27  WS2813B-V5  [LED-SMD_6P-L5.0-W5.0-TL]  85.5 51.5 90 top
LED28  WS2813B-V5  [LED-SMD_6P-L5.0-W5.0-TL]  85.5 38.5 90 top
LED29  WS2813B-V5  [LED-SMD_6P-L5.0-W5.0-TL]  85.5 30.75 90 top
LED30  WS2813B-V5  [LED-SMD_6P-L5.0-W5.0-TL]  85.5 23.25 90 top
LED31  WS2813B-V5  [LED-SMD_6P-L5.0-W5.0-TL]  77.5 16.5 0 top
LED32  WS2813B-V5  [LED-SMD_6P-L5.0-W5.0-TL]  70 16.5 0 top
LED33  WS2813B-V5  [LED-SMD_6P-L5.0-W5.0-TL]  62.5 16.5 0 top
LED34  WS2813B-V5  [LED-SMD_6P-L5.0-W5.0-TL]  54.5 23.25 270 top
LED35  WS2813B-V5  [LED-SMD_6P-L5.0-W5.0-TL]  54.5 30.75 270 top
LED36  WS2813B-V5  [LED-SMD_6P-L5.0-W5.0-TL]  54.5 38.5 270 top
LED37  WS2813B-V5  [LED-SMD_6P-L5.0-W5.0-TL]  54.5 51.5 270 top
LED38  WS2813B-V5  [LED-SMD_6P-L5.0-W5.0-TL]  54.5 59 270 top
LED39  WS2813B-V5  [LED-SMD_6P-L5.0-W5.0-TL]  54.5 66.5 270 top
LED40  WS2813B-V5  [LED-SMD_6P-L5.0-W5.0-TL]  77.5 45 0 top
LED41  WS2813B-V5  [LED-SMD_6P-L5.0-W5.0-TL]  70 45 0 top
LED42  WS2813B-V5  [LED-SMD_6P-L5.0-W5.0-TL]  62.5 45 0 top
LED43  WS2813B-V5  [LED-SMD_6P-L5.0-W5.0-TL]  17 73.5 180 top
LED44  WS2813B-V5  [LED-SMD_6P-L5.0-W5.0-TL]  24.5 73.5 180 top
LED45  WS2813B-V5  [LED-SMD_6P-L5.0-W5.0-TL]  32 73.5 180 top
LED46  WS2813B-V5  [LED-SMD_6P-L5.0-W5.0-TL]  40 66.5 90 top
LED47  WS2813B-V5  [LED-SMD_6P-L5.0-W5.0-TL]  40 59 90 top
LED48  WS2813B-V5  [LED-SMD_6P-L5.0-W5.0-TL]  40 51.5 90 top
LED49  WS2813B-V5  [LED-SMD_6P-L5.0-W5.0-TL]  40 38.5 90 top
LED50  WS2813B-V5  [LED-SMD_6P-L5.0-W5.0-TL]  40 30.75 90 top
LED51  WS2813B-V5  [LED-SMD_6P-L5.0-W5.0-TL]  40 23.25 90 top
LED52  WS2813B-V5  [LED-SMD_6P-L5.0-W5.0-TL]  32 16.5 0 top
LED53  WS2813B-V5  [LED-SMD_6P-L5.0-W5.0-TL]  24.5 16.5 0 top
LED54  WS2813B-V5  [LED-SMD_6P-L5.0-W5.0-TL]  17 16.5 0 top
LED55  WS2813B-V5  [LED-SMD_6P-L5.0-W5.0-TL]  9 23.25 270 top
LED56  WS2813B-V5  [LED-SMD_6P-L5.0-W5.0-TL]  9 30.75 270 top
LED57  WS2813B-V5  [LED-SMD_6P-L5.0-W5.0-TL]  9 38.5 270 top
LED58  WS2813B-V5  [LED-SMD_6P-L5.0-W5.0-TL]  9 51.5 270 top
LED59  WS2813B-V5  [LED-SMD_6P-L5.0-W5.0-TL]  9 59 270 top
LED60  WS2813B-V5  [LED-SMD_6P-L5.0-W5.0-TL]  9 66.5 270 top
LED61  WS2813B-V5  [LED-SMD_6P-L5.0-W5.0-TL]  32 45 0 top
LED62  WS2813B-V5  [LED-SMD_6P-L5.0-W5.0-TL]  24.5 45 0 top
LED63  WS2813B-V5  [LED-SMD_6P-L5.0-W5.0-TL]  17 45 0 top
NOREF  -  [Pad_e19]  130.5 3.5 0 top
NOREF#2  -  [Pad_e17]  9.5 3.5 0 top
NOREF#3  -  [Pad_e14]  9.5 86.5 0 top
NOREF#4  -  [Pad_e18]  130.5 86.5 0 top
U2  AP63205WU-7  [TSOT-23-6_L2.9-W1.6-P0.95-LS2.8-BL]  72.75 28.1 90 top

## Footprints (pads in the part's own frame, mm; a bottom-side part is the same pattern mirrored in y, then rotated)
C1206
  rect 1.485x1.728 smd: 1(-1.593,0) 2(1.593,0)
C1210
  rect 1.635x2.7 smd: 1(-1.518,0) 2(1.518,0)
CONN_1814605
  round 1.702 hole 1.194: 1(-6.251,-1.576) 2(-6.251,1.524) 3(-3.751,-1.576) 4(-3.751,1.524) 5(-1.251,-1.576) 6(-1.251,1.524) 7(1.249,-1.576) 8(1.249,1.524) 9(3.749,-1.576) 10(3.749,1.524) 11(6.249,-1.576) 12(6.249,1.524)
HDR-TH_2P-P2.54-V-M
  rect 2x2 hole 1.2: 1(-1.27,0)
  round 2 hole 1.2: 2(1.27,0)
IND-SMD_L3.2-W2.5_CMI3225XX
  rect 1.6x2.6 smd: 1(-1.6,0) 2(1.6,0)
LED-SMD_6P-L5.0-W5.0-TL
  rect 1.5x1 smd: 1(-2.4,1.6) 2(-2.4,0) 3(-2.4,-1.6) 4(2.4,-1.6) 5(2.4,0) 6(2.4,1.6)
Pad_e14
  round 5.5 hole 4: 1(0,0)
Pad_e17
  round 5.5 hole 4: 3(0,0)
Pad_e18
  round 5.5 hole 4: 2(0,0)
Pad_e19
  round 5.5 hole 4: 4(0,0)
TSOT-23-6_L2.9-W1.6-P0.95-LS2.8-BL
  rect 0.55x1.2 smd: 1(-0.95,-1.2) 2(0,-1.2) 3(0.95,-1.2) 4(0.95,1.2) 5(0,1.2) 6(-0.95,1.2)

## Nets
As in the schematic.

Pads without a net: NOREF 4; NOREF#2 3; NOREF#3 1; NOREF#4 2

## Via types
v1: diameter 0.61, hole 0.304, Top Layer to Bottom Layer, 300 vias
v2: diameter 1, hole 0.5, Top Layer to Bottom Layer, 96 vias
v3: diameter 0.61, hole 0.305, Top Layer to Bottom Layer, 8 vias
v4: diameter 1.5, hole 0.75, Top Layer to Bottom Layer, 1 via

## Routing (per net, layer and track width the routed paths; a pad name or vN(x,y) marks a point on that pad's centre or on a via; arc(x,y) is an arc through that point)
+5V: length 1184.6
  Top Layer w0.5: LED63.2 13.6,45 12.2,46.4 12.2,51.5 ; LED14.2 100,32.15 98.6,30.75 86.9,30.75 85.5,29.35 LED29.2 ; LED39.2 54.5,67.9 53.1,66.5 41.4,66.5 40,65.1 LED46.2 ; LED47.2 40,57.6 41.4,59 53.1,59 54.5,60.4 LED38.2 ; LED18.2 100,67.9 98.6,66.5 86.9,66.5 85.5,65.1 LED25.2 ; LED35.2 54.5,32.15 53.1,30.75 41.4,30.75 40,29.35 LED50.2 ; 136.3,59 132.4,59 131,57.6 LED5.2 ; 115.5,11.2 115.5,15.1 114.1,16.5 LED11.2 ; 24.5,11.2 24.5,15.1 23.1,16.5 LED53.2 ; 12.2,51.5 9,51.5 ; 12.2,51.5 24.5,51.5 ; 70,51.5 76.3,51.5 77.5,50.3 77.5,46.4 76.1,45 LED40.2 ; 70,51.5 70,46.4 68.6,45 LED41.2 ; 70,51.5 62.5,51.5 ; 3.45,38.5 7.6,38.5 9,39.9 LED57.2 ; 17,11.2 17,15.1 15.6,16.5 LED54.2 ; LED44.2 25.9,73.5 24.5,74.9 24.5,78.8 ; LED43.2 18.4,73.5 17,74.9 17,78.8 ; 136.3,23.25 132.4,23.25 131,21.85 LED9.2 ; LED51.2 40,21.85 41.4,23.25 53.1,23.25 54.5,24.65 LED34.2 ; 32,11.2 32,15.1 30.6,16.5 LED52.2 ; 62.5,11.2 62.5,15.1 61.1,16.5 LED33.2 ; LED23.2 71.4,73.5 70,74.9 70,78.8 ; 24.5,51.5 30.8,51.5 32,50.3 32,46.4 30.6,45 LED61.2 ; 24.5,51.5 24.5,46.4 23.1,45 LED62.2 ; 3.45,23.35 7.6,23.35 9,24.75 9,25.75 ; 62.5,78.8 62.5,74.9 63.9,73.5 LED22.2 ; 115.5,78.8 115.5,74.9 116.9,73.5 LED2.2 ; 3.45,66.5 7.6,66.5 9,67.9 LED60.2 ; LED19.2 121.6,45 123,46.4 123,50.3 121.8,51.5 115.5,51.5 115.5,46.4 114.1,45 LED20.2 ; LED48.2 40,50.1 41.4,51.5 54.5,51.5 ; 70,11.2 70,15.1 68.6,16.5 LED32.2 ; 9,51.5 3.45,51.5 ; 9,51.5 LED58.2 ; 123,11.2 123,15.1 121.6,16.5 LED10.2 ; LED31.2 76.1,16.5 77.5,15.1 77.5,11.2 ; 136.3,38.5 132.4,38.5 131,37.1 LED7.2 ; 90.8,51.5 86.9,51.5 85.5,50.1 LED27.2 ; 108,51.5 108,46.4 106.6,45 LED21.2 ; LED3.2 124.4,73.5 123,74.9 123,78.8 ; LED17.2 100,60.4 98.6,59 86.9,59 85.5,57.6 LED26.2 ; 3.45,30.75 7.6,30.75 9,32.15 LED56.2 ; LED24.2 78.9,73.5 77.5,74.9 77.5,78.8 ; LED30.2 85.5,21.85 86.9,23.25 98.6,23.25 100,24.65 LED13.2 ; 108,78.8 108,74.9 109.4,73.5 LED1.2 ; 136.3,51.5 132.4,51.5 131,50.1 LED6.2 ; 32,78.8 32,74.9 33.4,73.5 LED45.2 ; 3.45,59 7.6,59 9,60.4 LED59.2 ; LED15.2 100,39.9 98.6,38.5 90.8,38.5 ; 136.3,66.4 132.4,66.4 131,65 131,64 ; LED12.2 106.6,16.5 108,15.1 108,11.2 ; LED37.2 54.5,51.5 ; 54.5,51.5 62.5,51.5 ; 62.5,51.5 62.5,46.4 61.1,45 LED42.2 ; LED8.2 131,29.35 132.4,30.75 136.3,30.75 ; 85.5,38.5 LED28.2
  Top Layer w0.55: U2.1 75.55,27.15 76.45,26.25 76.45,21.55 75.85,20.95 66.7,20.95 65.28,22.37 C4.1
  Top Layer w1: 90.8,38.5 83,38.5 ; 90.8,38.5 90.8,51.5 ; 90.8,38.5 90.8,11.2 ; 100,51.5 115.5,51.5 ; 100,51.5 90.8,51.5 ; 100,51.5 LED16.2 ; 90.8,51.5 90.8,78.8 ; 45.3,11.2 6.9,11.2 3.45,14.65 3.45,75 7.25,78.8 132.55,78.8 136.3,75.05 136.3,14.65 132.85,11.2 90.8,11.2 ; 45.3,11.2 90.8,11.2 ; 45.3,11.2 45.3,78.8 ; 45.35,39.08 54.5,39.08 ; 54.5,39.08 57.2,39.08 57.2,39.07 ; 54.5,39.08 LED36.2 ; LED49.2 40,39.1
  Top Layer w1.5: H1.5 H1.6 114.25,54.87 115.5,53.62 115.5,51.5 ; 45.27,39.1 27.8,39.1 23.25,34.55 23.25,29.17 ; 57.2,39.07 65.63,39.07 66.23,38.47 82.8,38.45
  Bottom Layer w1.5: H2.5 H2.6 ; H1.5 H1.6
GND: length 358.5
  Top Layer w0.55: v2(40,42.5) 39.95,42.55 v2(39.95,47.6) ; v2(40,18.35) 38.15,16.5 v2(35.9,16.5) LED52.5 ; LED4.5 v2(131,70.4) 131,71.5 129,73.5 v2(126.9,73.5) ; v2(81.4,73.45) 83.5,73.45 85.5,71.45 v2(85.5,70.35) LED25.5 ; LED13.5 100,18.2 101.75,16.45 v2(104.1,16.45) ; v2(85.5,18.35) 83.65,16.5 v2(81.4,16.5) LED31.5 ; v2(82.05,21.65) 82.05,30.3 77.95,34.4 v2(72.03,34.4) ; LED10.5 v2(126.9,16.5) 129.05,16.5 131,18.45 v2(131,19.35) ; LED55.5 9,18.2 10.75,16.45 v2(13.1,16.45) ; v2(103.1,69.45) 119.15,69.45 126.7,61.9 126.7,45.35 126.35,45 LED19.5 ; v2(54.5,42.4) v2(54.5,47.5) ; LED34.5 54.5,18.2 56.25,16.45 v2(58.6,16.45) ; v2(9,42.4) v2(9,47.5) ; LED40.5 80.85,45 81.2,45.35 81.2,49.15 60.95,69.4 v2(57.65,69.4) ; LED61.5 35.3,45 35.8,45.5 35.8,49.9 16.35,69.35 v2(12.2,69.35) ; v2(40,70.4) 40,71.5 38,73.5 v2(35.9,73.5) ; LED7.5 v2(131,47.65) ; v2(100,42.4) v2(100,47.5) ; v2(85.45,47.6) 85.5,47.55 v2(85.5,42.5) ; v1(15.92,39.84) 18.25,37.51 H2.1 ; v1(15.92,34.76) v1(15.92,29.68)
  Top Layer w1: LED13.5 v2(100,22.45) ; LED3.5 v2(122.2,73.5) ; LED29.5 v2(85.5,31.55) ; LED24.5 v2(76.7,73.5) ; v2(54.5,37.7) LED36.5 ; LED15.5 v2(100,37.7) ; LED54.5 v2(17.8,16.5) ; 68.32,22.4 C4.2 ; LED59.5 v2(9,58.2) ; LED6.5 v2(131,52.3) ; LED35.5 v2(54.5,29.95) ; LED39.5 v2(54.5,65.7) ; LED50.5 v2(40,31.55) ; LED47.5 v2(40,59.8) ; LED58.5 v2(9,47.5) ; LED14.5 v2(100,29.95) ; LED41.5 v2(70.8,45) ; LED4.5 v2(131,67.3) ; LED32.5 v2(70.8,16.5) ; LED62.5 v2(25.3,45) ; LED56.5 v2(9,29.95) ; LED60.5 v2(9,65.7) ; LED63.5 v2(17.8,45) ; LED44.5 v2(23.7,73.5) ; v2(85.5,42.5) LED28.5 ; LED34.5 v2(54.5,22.45) ; LED16.5 v2(100,47.5) ; LED49.5 v2(40,42.5) ; LED26.5 v2(85.5,59.8) ; LED37.5 v2(54.5,47.5) ; LED31.5 v2(78.3,16.5) ; LED43.5 v2(16.2,73.5) ; LED11.5 v2(116.3,16.5) ; LED10.5 v2(123.8,16.5) ; LED23.5 v2(69.2,73.5) ; LED42.5 v2(63.3,45) ; LED27.5 v2(85.5,52.3) ; LED45.5 v2(31.2,73.5) ; LED57.5 v2(9,37.7) ; LED51.5 v2(40,24.05) ; LED7.5 v2(131,39.3) ; LED25.5 v2(85.5,67.3) ; LED30.5 v2(85.5,24.05) ; LED9.5 v2(131,24.05) ; LED5.5 v2(131,59.8) ; LED8.5 v2(131,31.55) ; LED33.5 v2(63.3,16.5) ; LED48.5 v2(40,52.3) ; LED55.5 v2(9,22.45) ; LED12.5 v2(108.8,16.5) ; LED38.5 v2(54.5,58.2) ; LED2.5 v2(114.7,73.5) ; LED18.5 v2(100,65.7) ; LED46.5 v2(40,67.3) ; LED21.5 v2(108.8,45) ; LED61.5 v2(32.8,45) ; LED22.5 v2(61.7,73.5) ; LED40.5 v2(78.3,45) ; LED52.5 v2(32.8,16.5) ; LED19.5 v2(123.8,45) ; LED1.5 v2(107.2,73.5) ; LED17.5 v2(100,58.2) ; LED20.5 v2(116.3,45) ; LED53.5 v2(25.3,16.5)
  Top Layer w1.5: H1.1 H1.2 ; 18.25,32.27 18.25,29.17
  vias: v1(0.68,85.56) v1(0.68,80.48) v1(0.68,75.4) v1(0.68,70.32) v1(0.68,65.24) v1(0.68,60.16) v1(0.68,55.08) v1(0.68,50) v1(0.68,44.92) v1(0.68,39.84) v1(0.68,34.76) v1(0.68,29.68) v1(0.68,24.6) v1(0.68,19.52) v1(0.68,14.44) v1(0.68,9.36) v1(0.68,4.28) v1(5.76,85.56) v1(5.76,80.48) v1(5.76,75.4) v1(5.76,70.32) v1(5.76,65.24) v1(5.76,60.16) v1(5.76,55.08) v1(5.76,50) v1(5.76,44.92) v1(5.76,39.84) v1(5.76,34.76) v1(5.76,29.68) v1(5.76,24.6) v1(5.76,19.52) v1(5.76,14.44) v1(5.76,9.36) v1(5.76,4.28) v1(10.84,80.48) v1(10.84,60.16) v1(10.84,29.68) v1(10.84,9.36) v1(15.92,85.56) v1(15.92,80.48) v1(15.92,75.4) v1(15.92,65.24) v1(15.92,60.16) v1(15.92,55.08) v1(15.92,50) v1(15.92,24.6) v1(15.92,19.52) v1(15.92,14.44) v1(15.92,9.36) v1(15.92,4.28) v1(21,85.56) v1(21,80.48) v1(21,70.32) v1(21,60.16) v1(21,55.08) v1(21,50) v1(21,39.84) v1(21,24.6) v1(21,19.52) v1(21,9.36) v1(21,4.28) v1(26.08,85.56) v1(26.08,80.48) v1(26.08,70.32) v1(26.08,65.24) v1(26.08,55.08) v1(26.08,50) v1(26.08,39.84) v1(26.08,34.76) v1(26.08,24.6) v1(26.08,19.52) v1(26.08,9.36) v1(26.08,4.28) v1(31.16,85.56) v1(31.16,80.48) v1(31.16,75.4) v1(31.16,70.32) v1(31.16,65.24) v1(31.16,60.16) v1(31.16,50) v1(31.16,24.6) v1(31.16,19.52) v1(31.16,14.44) v1(31.16,9.36) v1(31.16,4.28) v1(36.24,85.56) v1(36.24,80.48) v1(36.24,70.32) v1(36.24,65.24) v1(36.24,60.16) v1(36.24,55.08) v1(36.24,34.76) v1(36.24,19.52) v1(36.24,9.36) v1(36.24,4.28) v1(41.32,85.56) v1(41.32,80.48) v1(41.32,75.4) v1(41.32,60.16) v1(41.32,14.44) v1(41.32,9.36) v1(41.32,4.28) v1(46.4,85.56) v1(46.4,80.48) v1(46.4,75.4) v1(46.4,70.32) v1(46.4,55.08) v1(46.4,44.92) v1(46.4,34.76) v1(46.4,14.44) v1(46.4,9.36) v1(46.4,4.28) v1(51.48,85.56) v1(51.48,80.48) v1(51.48,75.4) v1(51.48,70.32) v1(51.48,65.24) v1(51.48,60.16) v1(51.48,55.08) v1(51.48,50) v1(51.48,44.92) v1(51.48,34.76) v1(51.48,29.68) v1(51.48,24.6) v1(51.48,14.44) v1(51.48,9.36) v1(51.48,4.28) v1(56.56,85.56) v1(56.56,80.48) v1(56.56,60.16) v1(56.56,29.68) v1(56.56,9.36) v1(56.56,4.28) v1(61.64,85.56) v1(61.64,80.48) v1(61.64,75.4) v1(61.64,65.24) v1(61.64,60.16) v1(61.64,55.08) v1(61.64,50) v1(61.64,34.76) v1(61.64,29.68) v1(61.64,24.6) v1(61.64,14.44) v1(61.64,9.36) v1(61.64,4.28) v1(66.72,85.56) v1(66.72,80.48) v1(66.72,70.32) v1(66.72,60.16) v1(66.72,55.08) v1(66.72,50) v1(66.72,9.36) v1(66.72,4.28) v1(71.8,85.56) v1(71.8,80.48) v1(71.8,70.32) v1(71.8,65.24) v1(71.8,55.08) v1(71.8,50) v1(71.8,39.84) v1(71.8,9.36) v1(71.8,4.28) v1(76.88,85.56) v1(76.88,80.48) v1(76.88,70.32) v1(76.88,65.24) v1(76.88,60.16) v1(76.88,39.84) v1(76.88,34.76) v1(76.88,9.36) v1(76.88,4.28) v1(81.96,85.56) v1(81.96,80.48) v1(81.96,70.32) v1(81.96,65.24) v1(81.96,60.16) v1(81.96,55.08) v1(81.96,39.84) v1(81.96,34.76) v1(81.96,29.68) v1(81.96,24.6) v1(81.96,9.36) v1(81.96,4.28) v1(87.04,85.56) v1(87.04,80.48) v1(87.04,75.4) v1(87.04,60.16) v1(87.04,29.68) v1(87.04,14.44) v1(87.04,9.36) v1(87.04,4.28) v1(92.12,85.56) v1(92.12,80.48) v1(92.12,75.4) v1(92.12,70.32) v1(92.12,60.16) v1(92.12,55.08) v1(92.12,50) v1(92.12,44.92) v1(92.12,39.84) v1(92.12,34.76) v1(92.12,24.6) v1(92.12,14.44) v1(92.12,9.36) v1(92.12,4.28) v1(97.2,85.56) v1(97.2,80.48) v1(97.2,75.4) v1(97.2,70.32) v1(97.2,65.24) v1(97.2,60.16) v1(97.2,55.08) v1(97.2,50) v1(97.2,44.92) v1(97.2,39.84) v1(97.2,34.76) v1(97.2,29.68) v1(97.2,24.6) v1(97.2,14.44) v1(97.2,9.36) v1(97.2,4.28) v1(102.28,85.56) v1(102.28,80.48) v1(102.28,75.4) v1(102.28,60.16) v1(102.28,29.68) v1(102.28,9.36) v1(102.28,4.28) v1(107.36,85.56) v1(107.36,80.48) v1(107.36,65.24) v1(107.36,60.16) v1(107.36,55.08) v1(107.36,39.84) v1(107.36,34.76) v1(107.36,29.68) v1(107.36,24.6) v1(107.36,9.36) v1(107.36,4.28) v1(112.44,85.56) v1(112.44,80.48) v1(112.44,65.24) v1(112.44,55.08) v1(112.44,50) v1(112.44,39.84) v1(112.44,34.76) v1(112.44,24.6) v1(112.44,9.36) v1(112.44,4.28) v1(117.52,85.56) v1(117.52,80.48) v1(117.52,55.08) v1(117.52,39.84) v1(117.52,34.76) v1(117.52,19.52) v1(117.52,9.36) v1(117.52,4.28) v1(122.6,85.56) v1(122.6,80.48) v1(122.6,70.32) v1(122.6,24.6) v1(122.6,19.52) v1(122.6,9.36) v1(122.6,4.28) v1(127.68,80.48) v1(127.68,70.32) v1(127.68,65.24) v1(127.68,39.84) v1(127.68,34.76) v1(127.68,29.68) v1(127.68,24.6) v1(127.68,19.52) v1(127.68,9.36) v1(132.76,80.48) v1(132.76,75.4) v1(132.76,60.16) v1(132.76,29.68) v1(132.76,14.44) v1(132.76,9.36) v1(137.84,85.56) v1(137.84,80.48) v1(137.84,75.4) v1(137.84,70.32) v1(137.84,65.24) v1(137.84,60.16) v1(137.84,55.08) v1(137.84,50) v1(137.84,44.92) v1(137.84,39.84) v1(137.84,34.76) v1(137.84,29.68) v1(137.84,24.6) v1(137.84,19.52) v1(137.84,14.44) v1(137.84,9.36) v1(137.84,4.28) v2(68.32,22.4) v2(69.37,34.4) v2(70.5,29.85) v2(72.6,29.7)
VCC: length 139.4
  Top Layer w1.5: H1.11 H1.12 ; 30.75,32.27 30.75,29.17
  Bottom Layer w1.5: H2.11 H2.12 ; 30.75,29.17 40.02,19.9 v4(80.4,19.9) 112.5,19.9 121.75,29.15 H1.12 H1.11
BI: length 28.2
  Top Layer w1: J1.2 100.37,71.9 v2(104,71.9) LED1.6
  Top Layer w1.5: H1.3 H1.4
  Bottom Layer w1: v2(104,71.9) 111.75,64.15 H1.3
  Bottom Layer w1.5: H1.3 H1.4
BO: length 23.7
  Top Layer w0.5: LED63.1 15.6,46.6 16.6,45.6 16.6,41.55 20.75,37.4 20.75,32.27
  Top Layer w1.5: 20.75,32.27 20.75,29.17
  Bottom Layer w1.5: H2.3 H2.4
BO1: length 56
  Top Layer w0.5: v3(80.35,62.95) 71.4,62.95 62.45,71.9 LED22.6 ; LED21.1 v3(103.65,46.6)
  Bottom Layer w0.5: v3(103.65,46.6) 87.3,62.95 v3(80.35,62.95)
BO2: length 56
  Top Layer w0.5: LED42.1 v3(58.15,46.6) ; LED43.6 16.95,71.9 25.9,62.95 v3(34.85,62.95)
  Bottom Layer w0.5: v3(58.15,46.6) 41.8,62.95 v3(34.85,62.95)
DI: length 31
  Top Layer w1: LED1.4 v2(104,75.1)
  Top Layer w1.5: H1.7 H1.8
  Bottom Layer w1: H1.7 116.75,68.2 109.85,75.1 v2(104,75.1)
  Bottom Layer w1.5: H1.7 H1.8
DO: length 33.5
  Top Layer w0.5: 25.75,29.17 23.83,27.25 15.95,27.25 14.6,28.6 LED63.3
  Top Layer w1.5: 25.75,32.27 25.75,29.17
  Bottom Layer w1.5: H2.7 H2.8
DO1: length 65.5
  Top Layer w0.5: LED21.3 v3(103.65,43.4) ; LED22.4 v3(56.65,75.1)
  Bottom Layer w0.5: v3(56.65,75.1) 88.35,43.4 v3(103.65,43.4)
DO2: length 65.9
  Top Layer w0.5: LED42.3 v3(58.15,43.4) ; LED43.4 v3(11.15,75.1)
  Bottom Layer w0.5: v3(11.15,75.1) 11.15,74.55 42.3,43.4 v3(58.15,43.4)
EN: length 136.3
  Top Layer w0.55: v2(76.8,27.55) 76.25,28.1 U2.2
  Top Layer w1.5: H1.9 H1.10 ; 28.25,32.27 28.25,29.17
  Bottom Layer w1: H1.10 119.25,52.05 114.23,47.03 114.23,30.75 111.03,27.55 v2(76.8,27.55) 39.8,27.55 32.6,34.75 29.25,34.75 28.25,33.75 28.25,32.43
  Bottom Layer w1.5: H1.9 H1.10 ; H2.10 28.25,32.32
$2N332268: length 2.7
  Top Layer w1: LED1.3 LED2.4
$2N332275: length 2.7
  Top Layer w1: LED2.3 LED3.4
$2N332294: length 2.7
  Top Layer w1: LED1.1 LED2.6
$2N332300: length 2.7
  Top Layer w1: LED2.1 LED3.6
$2N332306: length 6.1
  Top Layer w1: LED3.1 127.81,71.9 129.4,70.31 LED4.6
$2N332313: length 12.3
  Top Layer w1: LED4.4 132.6,73.2 130.7,75.1 LED3.3
$2N332321: length 2.7
  Top Layer w1: LED4.1 LED5.6
$2N332324: length 2.7
  Top Layer w1: LED4.3 LED5.4
$2N332327: length 2.7
  Top Layer w1: LED5.1 LED6.6
$2N332330: length 2.7
  Top Layer w1: LED5.3 LED6.4
$2N332493: length 2.9
  Top Layer w1: LED7.1 LED8.6
$2N332495: length 2.9
  Top Layer w1: LED7.3 LED8.4
$2N332497: length 2.7
  Top Layer w1: LED8.1 LED9.6
$2N332499: length 2.7
  Top Layer w1: LED8.3 LED9.4
$2N332503: length 6
  Top Layer w1: LED10.6 128.06,18.1 129.4,19.44 LED9.1
$2N332507: length 12
  Top Layer w1: LED9.3 132.6,16.8 130.7,14.9 LED10.4
$2N332511: length 2.7
  Top Layer w1: LED10.3 LED11.4
$2N332514: length 2.7
  Top Layer w1: LED10.1 LED11.6
$2N332517: length 2.7
  Top Layer w1: LED11.1 LED12.6
$2N332520: length 2.7
  Top Layer w1: LED11.3 LED12.4
$2N332523: length 12
  Top Layer w1: LED12.3 100.3,14.9 98.4,16.8 LED13.4
$2N332527: length 6
  Top Layer w1: LED13.6 101.6,19.44 102.94,18.1 LED12.1
$2N332531: length 2.7
  Top Layer w1: LED13.3 LED14.4
$2N332534: length 2.7
  Top Layer w1: LED13.1 LED14.6
$2N332537: length 2.9
  Top Layer w1: LED14.3 LED15.4
$2N332543: length 2.9
  Top Layer w1: LED14.1 LED15.6
$2N332549: length 8.2
  Top Layer w1: LED15.3 LED16.4
$2N332556: length 8.2
  Top Layer w1: LED16.6 LED15.1
$2N332563: length 2.7
  Top Layer w1: LED16.3 LED17.4
$2N332570: length 2.7
  Top Layer w1: LED16.1 LED17.6
$2N332577: length 2.7
  Top Layer w1: LED17.3 LED18.4
$2N332584: length 2.7
  Top Layer w1: LED17.1 LED18.6
$2N332696: length 8.2
  Top Layer w1: LED6.1 LED7.6
$2N332699: length 8.2
  Top Layer w1: LED6.3 LED7.4
$2N332702: length 41.9
  Top Layer w0.5: LED19.6 125.4,61.65 118.65,68.4 102.1,68.4 LED18.1
$2N332706: length 54.1
  Top Layer w0.5: LED19.4 126.11,43.4 127.65,44.94 127.65,62.5 119.75,70.4 99,70.4 98.4,69.8 LED18.3
$2N332712: length 2.7
  Top Layer w1: LED19.1 LED20.6
$2N332718: length 2.7
  Top Layer w1: LED19.3 LED20.4
$2N332724: length 2.7
  Top Layer w1: LED20.1 LED21.6
$2N332731: length 2.7
  Top Layer w1: LED20.3 LED21.4
$2N335047: length 2.7
  Top Layer w1: LED22.3 LED23.4
$2N335051: length 2.7
  Top Layer w1: LED23.3 LED24.4
$2N335055: length 2.7
  Top Layer w1: LED22.1 LED23.6
$2N335060: length 2.7
  Top Layer w1: LED23.1 LED24.6
$2N335064: length 6.1
  Top Layer w1: LED24.1 82.31,71.9 83.9,70.31 LED25.6
$2N335069: length 12.3
  Top Layer w1: LED24.3 85.2,75.1 87.1,73.2 LED25.4
$2N335074: length 2.7
  Top Layer w1: LED25.1 LED26.6
$2N335078: length 2.7
  Top Layer w1: LED25.3 LED26.4
$2N335082: length 2.7
  Top Layer w1: LED26.1 LED27.6
$2N335086: length 2.7
  Top Layer w1: LED27.4 LED26.3
$2N335090: length 2.9
  Top Layer w1: LED28.1 LED29.6
$2N335094: length 2.9
  Top Layer w1: LED28.3 LED29.4
$2N335098: length 2.7
  Top Layer w1: LED29.1 LED30.6
$2N335102: length 2.7
  Top Layer w1: LED29.3 LED30.4
$2N335106: length 6.2
  Top Layer w1: LED30.1 83.9,19 83,18.1 LED31.6
$2N335111: length 12
  Top Layer w1: LED31.4 85.2,14.9 87.1,16.8 LED30.3
$2N335116: length 2.7
  Top Layer w1: LED31.3 LED32.4
$2N335120: length 2.7
  Top Layer w1: LED31.1 LED32.6
$2N335124: length 2.7
  Top Layer w1: LED32.1 LED33.6
$2N335128: length 2.7
  Top Layer w1: LED32.3 LED33.4
$2N335132: length 12
  Top Layer w1: LED34.4 52.9,16.8 54.8,14.9 LED33.3
$2N335137: length 6.2
  Top Layer w1: LED33.1 57,18.1 56.1,19 LED34.6
$2N335142: length 2.7
  Top Layer w1: LED34.3 LED35.4
$2N335146: length 2.7
  Top Layer w1: LED35.6 LED34.1
$2N335150: length 2.9
  Top Layer w1: LED35.3 LED36.4
$2N335154: length 2.9
  Top Layer w1: LED35.1 LED36.6
$2N335158: length 8.2
  Top Layer w1: LED36.3 LED37.4
$2N335162: length 8.2
  Top Layer w1: LED36.1 LED37.6
$2N335166: length 2.7
  Top Layer w1: LED37.3 LED38.4
$2N335170: length 2.7
  Top Layer w1: LED37.1 LED38.6
$2N335174: length 2.7
  Top Layer w1: LED38.3 LED39.4
$2N335178: length 2.7
  Top Layer w1: LED38.1 LED39.6
$2N335182: length 8.2
  Top Layer w1: LED27.1 LED28.6
$2N335186: length 8.2
  Top Layer w1: LED27.3 LED28.4
$2N335190: length 34.5
  Top Layer w0.5: LED39.1 56.6,68.4 60.55,68.4 79.9,49.05 LED40.6
$2N335193: length 46.6
  Top Layer w0.5: LED39.3 52.9,69.8 53.5,70.4 61.35,70.4 82.15,49.6 82.15,44.94 80.61,43.4 LED40.4
$2N335200: length 2.7
  Top Layer w1: LED40.1 LED41.6
$2N335204: length 2.7
  Top Layer w1: LED40.3 LED41.4
$2N335208: length 2.7
  Top Layer w1: LED41.1 LED42.6
$2N335212: length 2.7
  Top Layer w1: LED41.3 LED42.4
$2N338899: length 2.7
  Top Layer w1: LED43.3 LED44.4
$2N338903: length 2.7
  Top Layer w1: LED44.3 LED45.4
$2N338907: length 2.7
  Top Layer w1: LED43.1 LED44.6
$2N338911: length 2.7
  Top Layer w1: LED44.1 LED45.6
$2N338915: length 6.1
  Top Layer w1: LED46.6 38.4,70.31 36.81,71.9 LED45.1
$2N338920: length 12.3
  Top Layer w1: LED45.3 39.7,75.1 41.6,73.2 LED46.4
$2N338925: length 2.7
  Top Layer w1: LED46.1 LED47.6
$2N338929: length 2.7
  Top Layer w1: LED46.3 LED47.4
$2N338933: length 2.7
  Top Layer w1: LED47.1 LED48.6
$2N338937: length 2.7
  Top Layer w1: LED47.3 LED48.4
$2N338941: length 2.9
  Top Layer w1: LED49.1 LED50.6
$2N338945: length 2.9
  Top Layer w1: LED49.3 LED50.4
$2N338949: length 2.7
  Top Layer w1: LED50.1 LED51.6
$2N338953: length 2.7
  Top Layer w1: LED50.3 LED51.4
$2N338957: length 6
  Top Layer w1: LED52.6 37.06,18.1 38.4,19.44 LED51.1
$2N338962: length 12
  Top Layer w1: LED51.3 41.6,16.8 39.7,14.9 LED52.4
$2N338967: length 2.7
  Top Layer w1: LED52.3 LED53.4
$2N338971: length 2.7
  Top Layer w1: LED52.1 LED53.6
$2N338975: length 2.7
  Top Layer w1: LED53.1 LED54.6
$2N338979: length 2.7
  Top Layer w1: LED53.3 LED54.4
$2N338983: length 12
  Top Layer w1: LED55.4 7.4,16.8 9.3,14.9 LED54.3
$2N338988: length 6
  Top Layer w1: LED54.1 11.94,18.1 10.6,19.44 LED55.6
$2N338993: length 2.7
  Top Layer w1: LED55.3 LED56.4
$2N338997: length 2.7
  Top Layer w1: LED56.6 LED55.1
$2N339001: length 2.9
  Top Layer w1: LED56.3 LED57.4
$2N339005: length 2.9
  Top Layer w1: LED57.6 LED56.1
$2N339009: length 8.2
  Top Layer w1: LED57.3 LED58.4
$2N339013: length 8.2
  Top Layer w1: LED58.6 LED57.1
$2N339017: length 2.7
  Top Layer w1: LED58.3 LED59.4
$2N339021: length 2.7
  Top Layer w1: LED58.1 LED59.6
$2N339025: length 2.7
  Top Layer w1: LED59.3 LED60.4
$2N339029: length 2.7
  Top Layer w1: LED59.1 LED60.6
$2N339033: length 8.2
  Top Layer w1: LED48.1 LED49.6
$2N339037: length 8.2
  Top Layer w1: LED48.3 LED49.4
$2N339041: length 34.9
  Top Layer w0.5: LED61.6 34.4,49.75 15.75,68.4 11.1,68.4 LED60.1
$2N339044: length 47.2
  Top Layer w0.5: LED61.4 35.11,43.4 36.8,45.09 36.8,50.4 16.8,70.4 8,70.4 7.4,69.8 LED60.3
$2N339051: length 2.7
  Top Layer w1: LED61.1 LED62.6
$2N339055: length 2.7
  Top Layer w1: LED61.3 LED62.4
$2N339059: length 2.7
  Top Layer w1: LED62.1 LED63.6
$2N339063: length 2.7
  Top Layer w1: LED62.3 LED63.4
$3N5692: length 8.6
  Top Layer w0.55: L1.1 68.7,28.1 ; 68.7,28.1 69.33,28.1 ; 68.7,28.1 69.33,27.47 ; 69.33,28.1 U2.5 ; 69.33,28.1 69.33,27.47 ; 69.33,27.47 69.33,27.22 71.16,25.39 C2.2
$3N12733: length 3.9
  Top Layer w0.55: C2.1 74.3,24.4 U2.6

## Copper pours and planes (outline as drawn; the poured copper is in the pictures)
+5V on Top Layer: 64.39,23.25 66.15,23.25 66.15,29.7 67.2,30.65 67.2,39.9 64.4,39.9 64.4,23.26
GND on Top Layer: 68.5,34.97 68.5,30.75 70.89,28.7 72.4,28.7 72.4,27.25 72.8,26.85 73.1,26.85 73.1,34.97
GND on Bottom Layer: -4.4,91.2 144.6,91.2 144.6,-0.8 -4.4,-0.8
VCC on Top Layer: 74.2,33.45 75.95,33.45 75.95,30.65 81.15,25.7 81.15,19.15 79.65,19.15 79.65,25.95 76.85,28.77 73.35,28.77 73.35,29.42 74.2,30.65

Small or netless copper shapes (teardrops, artwork), in the pictures only: 210 on Top Layer, 4 on Bottom Layer

## Text on the board
Bottom Silkscreen Layer: GND | BO | 5V | DO | EN | VCC | BI | DI | VCC  EN | REV 1 | JES
